# Altium project SoM.PrjPcb (part 2 of 4)

## Sheet [3] RK3399_PMU.SchDoc
size B; Organization: Altium Limited; Address1: L3, 12a Rodborough Rd; Address2: Frenchs Forest; Address3: NSW; Address4: Australia 2086
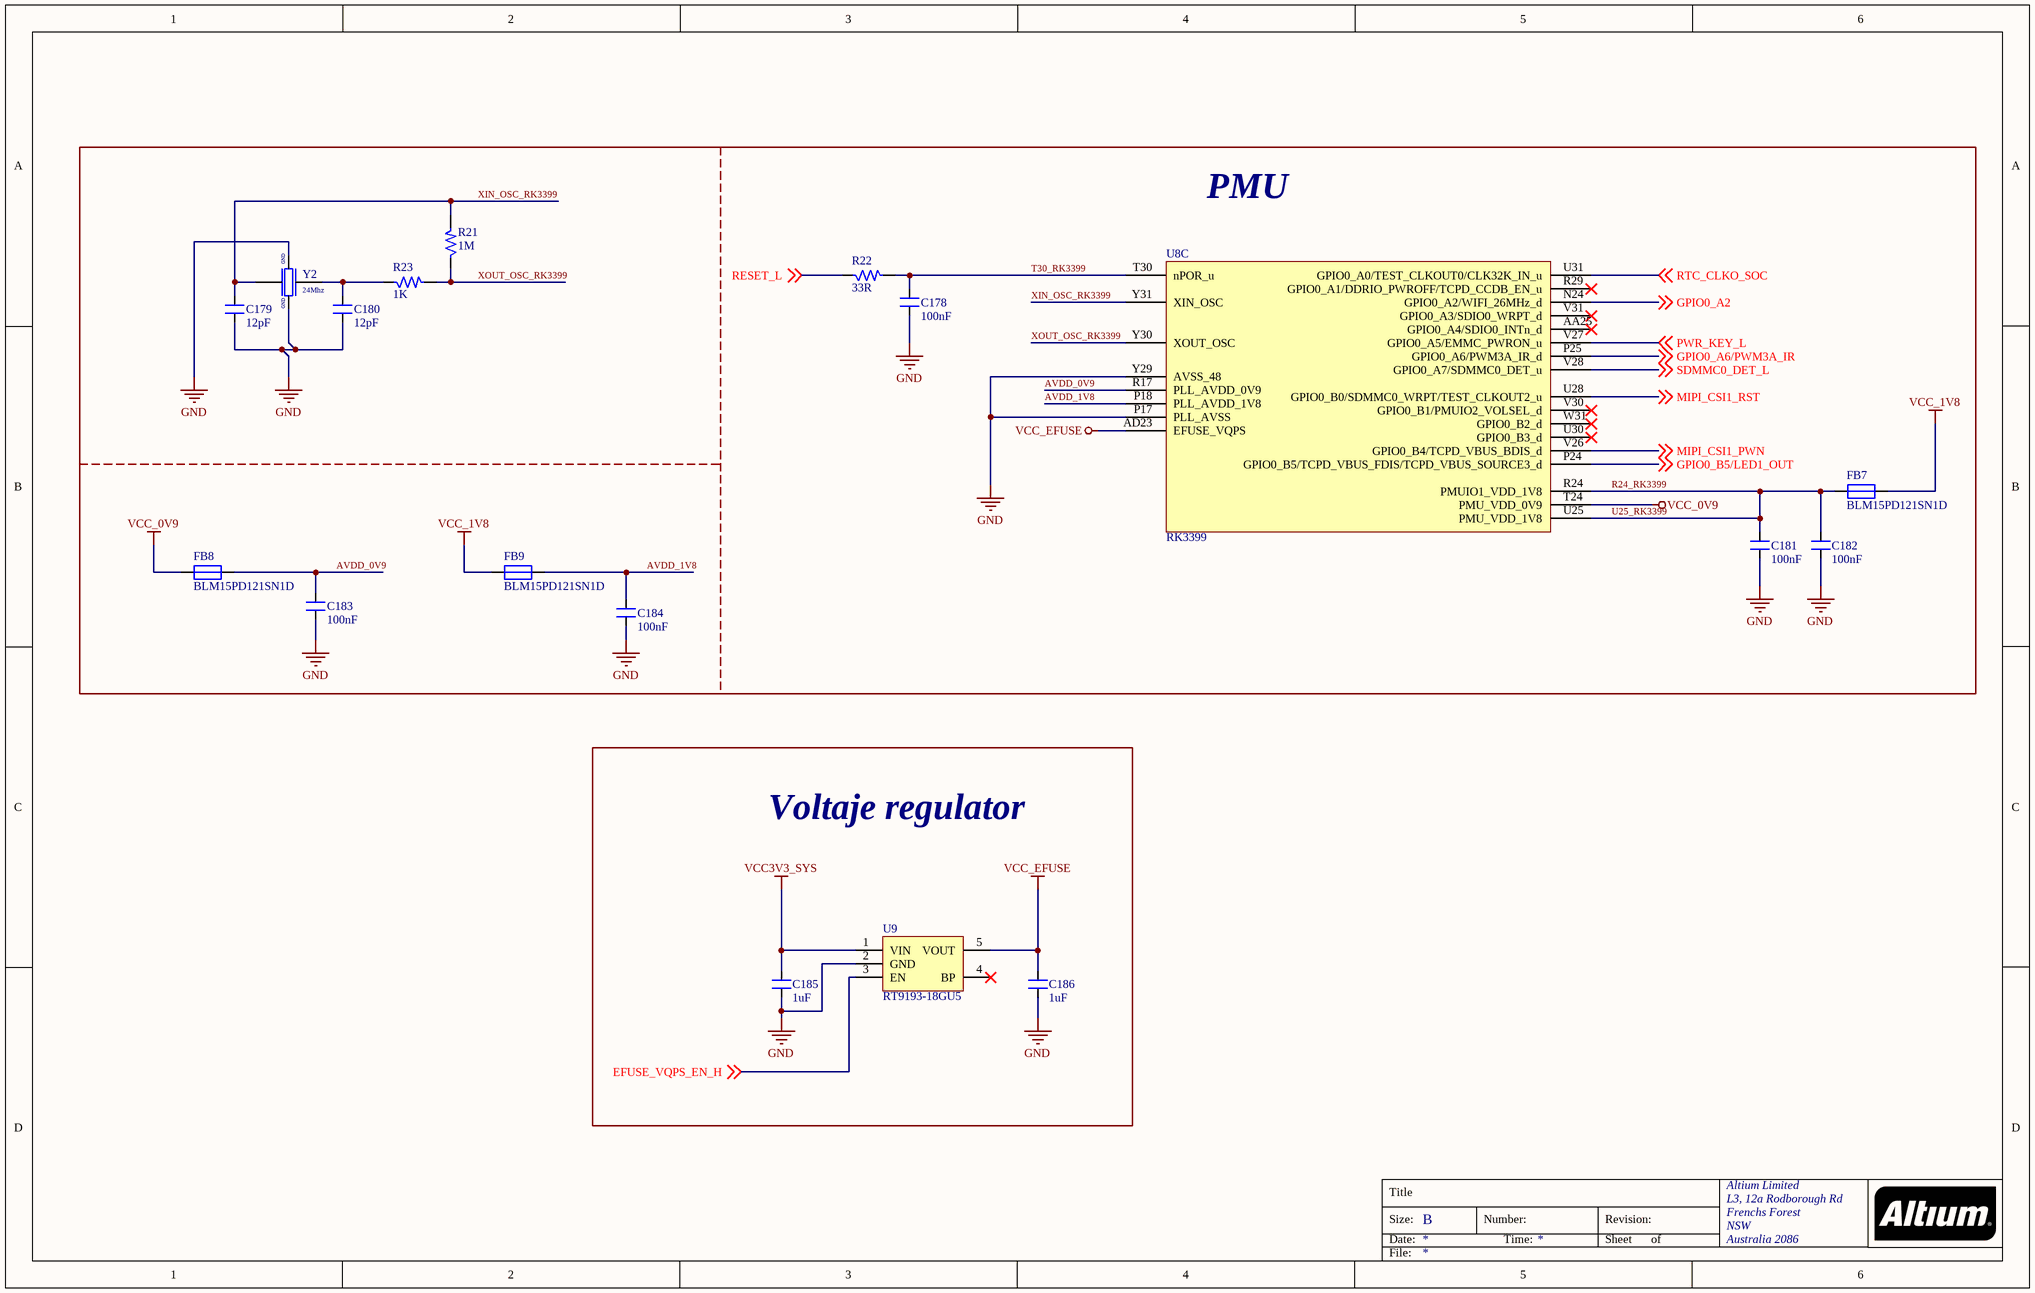
[diagram p6: [3] RK3399_PMU.SchDoc]

### Parts
C178  100nF  [CAP_0201]
C179  12pF  [CAP_0201]
C180  12pF  [CAP_0201]
C181  100nF  [CAP_0201]
C182  100nF  [CAP_0201]
C183  100nF  [CAP_0201]
C184  100nF  [CAP_0201]
C185  1uF  [CAP_0201]
C186  1uF  [CAP_0201]
FB7  BLM15PD121SN1D  [RES_0402]
FB8  BLM15PD121SN1D  [RES_0402]
FB9  BLM15PD121SN1D  [RES_0402]
R21  1M  [RES_0201]
R22  33R  [RES_0201]
R23  1K  [RES_0201]
U8  RK3399  [FBGA828_23_826X826]  (part C of 24)
U9  RT9193-18GU5  [SC70-5]
Y2  24Mhz  [XTAL_ABM8AIG-24.000MHZ-12-2Z-T3]

### Blocks framed on the sheet
PMU: C178-C184 FB7-FB9 R21-R23 U8 Y2
Voltaje regulator: C185 C186 U9

### Nets
GND: C178.1 C179.1 C180.1 C181.1 C182.1 C183.1 C184.1 C185.1 C186.1 U8.P17(PLL_AVSS) U8.Y29(AVSS_48) U9.2(GND) Y2.2 Y2.4
VCC3V3_SYS: C185.2 U9.1(VIN)  [project net VCC7]
VCC_0V9: FB8.1 U8.T24(PMU_VDD_0V9)  [project net EDP_AVDD_0V9]
VCC_1V8: FB7.2 FB9.1  [project net EDP_AVDD_1V8]
VCC_EFUSE: C186.2 U8.AD23(EFUSE_VQPS) U9.5(VOUT)
AVDD_0V9: C183.2 FB8.2 U8.R17(PLL_AVDD_0V9)
AVDD_1V8: C184.2 FB9.2 U8.P18(PLL_AVDD_1V8)
EFUSE_VQPS_EN_H: U9.3(EN) ; off-sheet EFUSE_VQPS_EN_H
GPIO0_A2: U8.N24(GPIO0_A2/WIFI_26MHz_d) ; off-sheet GPIO0_A2
GPIO0_A6/PWM3A_IR: U8.P25(GPIO0_A6/PWM3A_IR_d) ; off-sheet GPIO0_A6/PWM3A_IR
GPIO0_B5/LED1_OUT: U8.P24(GPIO0_B5/TCPD_VBUS_FDIS/TCPD_VBUS_SOURCE3_d) ; off-sheet GPIO0_B5/LED1_OUT
MIPI_CSI1_PWN: U8.V26(GPIO0_B4/TCPD_VBUS_BDIS_d) ; off-sheet MIPI_CSI1_PWN
MIPI_CSI1_RST: U8.U28(GPIO0_B0/SDMMC0_WRPT/TEST_CLKOUT2_u) ; off-sheet MIPI_CSI1_RST
PWR_KEY_L: U8.V27(GPIO0_A5/EMMC_PWRON_u) ; off-sheet PWR_KEY_L
R24_RK3399: C181.2 C182.2 FB7.1 U8.R24(PMUIO1_VDD_1V8) U8.U25(PMU_VDD_1V8)  [also labelled U25_RK3399]
RESET_L: R22.1 ; off-sheet RESET_L  [project net RespWROM]
RTC_CLKO_SOC: U8.U31(GPIO0_A0/TEST_CLKOUT0/CLK32K_IN_u) ; off-sheet RTC_CLKO_SOC
SDMMC0_DET_L: U8.V28(GPIO0_A7/SDMMC0_DET_u) ; off-sheet SDMMC0_DET_L
T30_RK3399: C178.2 R22.2 U8.T30(nPOR_u)
XIN_OSC_RK3399: C179.2 R21.2 U8.Y31(XIN_OSC) Y2.1
XOUT_OSC_RK3399: R21.1 R23.2 U8.Y30(XOUT_OSC)
NetC180_2: C180.2 R23.1 Y2.3

Not connected (* = marked no-connect by the designer): U8 AA25(GPIO0_A4/SDIO0_INTn_d)* R29(GPIO0_A1/DDRIO_PWROFF/TCPD_CCDB_EN_u)* U30(GPIO0_B3_d)* V30(GPIO0_B1/PMUIO2_VOLSEL_d)* V31(GPIO0_A3/SDIO0_WRPT_d)* W31(GPIO0_B2_d)*; U9 4(BP)*

### Notes on the sheet
- Title
- Size:
- Date:
- B
- Number:
- Time:
- Revision:
- Sheet
- of
- File:
- (in symbol XTAL_24Mhz-12pF-4-SMD) GND

### Library data of the parts
C178 C181-C184 = CAP_100nF-25V-10%-0201: as C5 on sheet [9] LPDDR4_SDRAM1; Case/Package: 0201; Supplier-1: Digikey
C179 C180 = CAP_12pF-16V-10%-0201: 12pF ±10% 16V Ceramic Capacitor C0G, NP0 0201 (0603 Metric) /; Manufacturer: AVX Corporation; Manufacturer Part Number: 0201YA120KAT2A; Case/Package: 0201; Supplier-1: Digikey
C185 C186 = CAP_1uF-16V-10%-0201: as C3 on sheet [9] LPDDR4_SDRAM1; Case/Package: 0201; Supplier-1: Digikey
FB7-FB9 = FB_120R-1.3A-100Mhz-0402: as FB1 on sheet [9] LPDDR4_SDRAM1; Mnaufacturer Part Number: BLM15PD121SN1D; Case/Package: 0402; Supplier-1: Digikey
R21 = RES_1M-0.05W-1%-0201: 1 MOhms ±1% 0.05W, 1/20W Chip Resistor 0201 (0603 Metric) Thick Film /; Manufacturer: Yageo; Manufacturer Part Number: RC0201FR-071ML; Case/Package: 0201; Supplier-1: Digikey
R22 = RES_33R-0.05W-1%-0201: 33 Ohms ±1% 0.05W, 1/20W Chip Resistor 0201 (0603 Metric) Thick Film /; Manufacturer: Yageo; Manufacturer Part Number: RC0201FR-0733RL; Case/Package: 0201; Supplier-1: Digikey
R23 = RES_1K-0.05W-1%-0201: 1 kOhms ±1% 0.05W, 1/20W Chip Resistor 0201 (0603 Metric) Thick Film /; Manufacturer: Yageo; Manufacturer Part Number: RC0201FR-071KL; Case/Package: 0201; Supplier-1: Digikey
U8 = IC_RK3399-FCBGA828: as U8 on sheet [1] RK3399_PowerPins; Manufacturer Part Number: RK3399; Case/Package: FCBGA828; Supplier-1: Rockchip
U9 = REG_1.8V-300mA-5.5V-SC70-5: Linear Voltage Regulator IC 1 Output 300mA SC-70-5; Manufacturer: Richtek USA Inc.; Manufacturer Part Number: RT9193-18GU5; Case/Package: SC70-5; Supplier-1: Digikey
Y2 = XTAL_24Mhz-12pF-4-SMD: 24MHz ±20ppm Crystal 12pF 50 Ohms 4-SMD, No Lead /; Manufacturer: Abracon LLC; Manufacturer Part Number: ABM8AIG-24.000MHZ-12-2Z-T3; Case/Package: SMD; Supplier-1: Digikey

## Sheet [4] RK3399_EMMC_ADC_PCIE.SchDoc: RK3399, EMMC and ADCs
size B; DocumentNumber: I; Revision: 01; SheetNumber: 4; SheetTotal: 19
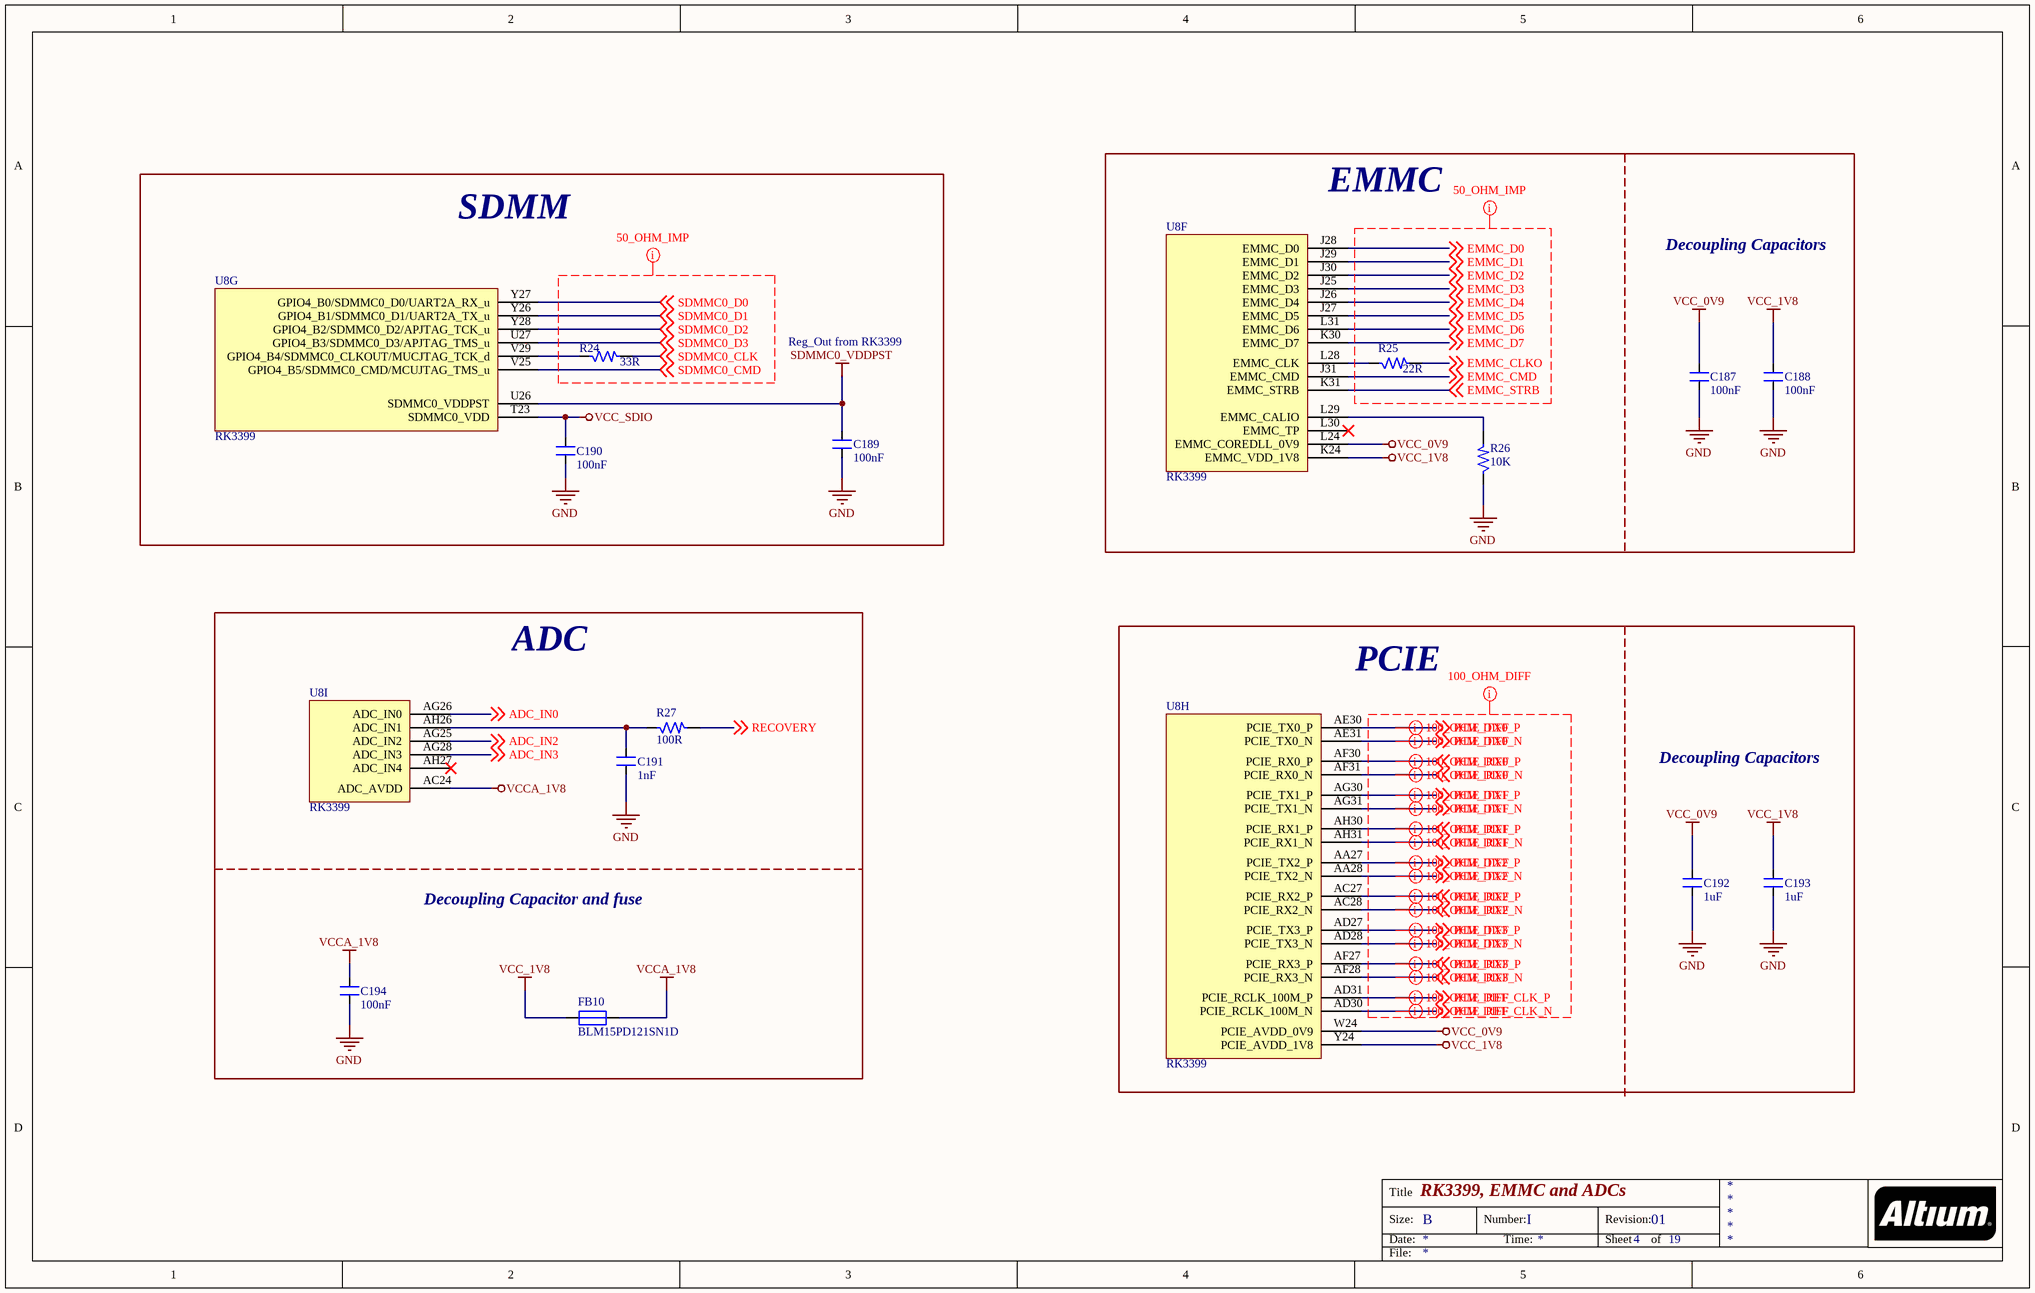
[diagram p7: [4] RK3399_EMMC_ADC_PCIE.SchDoc]

### Parts
C187  100nF  [CAP_0201]
C188  100nF  [CAP_0201]
C189  100nF  [CAP_0201]
C190  100nF  [CAP_0201]
C191  1nF  [CAP_0201]
C192  1uF  [CAP_0201]
C193  1uF  [CAP_0201]
C194  100nF  [CAP_0201]
FB10  BLM15PD121SN1D  [RES_0402]
R24  33R  [RES_0201]
R25  22R  [RES_0201]
R26  10K  [RES_0201]
R27  100R  [RES_0201]
U8  RK3399  [FBGA828_23_826X826]  (parts F,G,H,I of 24)

### Blocks framed on the sheet
SDMM: C189 C190 R24 U8
EMMC: C187 C188 R25 R26 U8
ADC: C191 C194 FB10 R27 U8
PCIE: C192 C193 U8

### Nets
GND: C187.1 C188.1 C189.1 C190.1 C191.1 C192.1 C193.1 C194.1 R26.1
SDMMC0_VDDPST: C189.2 U8.U26(SDMMC0_VDDPST)
VCC_0V9: C187.2 C192.2 U8.L24(EMMC_COREDLL_0V9) U8.W24(PCIE_AVDD_0V9)  [project net EDP_AVDD_0V9]
VCC_1V8: C188.2 C193.2 FB10.1 U8.K24(EMMC_VDD_1V8) U8.Y24(PCIE_AVDD_1V8)  [project net EDP_AVDD_1V8]
VCC_SDIO: C190.2 U8.T23(SDMMC0_VDD)  [project net VLDO4]
VCCA_1V8: C194.2 FB10.2 U8.AC24(ADC_AVDD)
ADC_IN0: U8.AG26(ADC_IN0) ; off-sheet ADC_IN0
ADC_IN2: U8.AG25(ADC_IN2) ; off-sheet ADC_IN2
ADC_IN3: U8.AG28(ADC_IN3) ; off-sheet ADC_IN3
EMMC_CLKO: R25.2 ; off-sheet EMMC_CLKO
EMMC_CMD: U8.J31(EMMC_CMD) ; off-sheet EMMC_CMD
EMMC_D0: U8.J28(EMMC_D0) ; off-sheet EMMC_D0
EMMC_D1: U8.J29(EMMC_D1) ; off-sheet EMMC_D1
EMMC_D2: U8.J30(EMMC_D2) ; off-sheet EMMC_D2
EMMC_D3: U8.J25(EMMC_D3) ; off-sheet EMMC_D3
EMMC_D4: U8.J26(EMMC_D4) ; off-sheet EMMC_D4
EMMC_D5: U8.J27(EMMC_D5) ; off-sheet EMMC_D5
EMMC_D6: U8.L31(EMMC_D6) ; off-sheet EMMC_D6
EMMC_D7: U8.K30(EMMC_D7) ; off-sheet EMMC_D7
EMMC_STRB: U8.K31(EMMC_STRB) ; off-sheet EMMC_STRB
PCIE_REF_CLK_N: U8.AD30(PCIE_RCLK_100M_N) ; off-sheet PCIE_REF_CLK_N
PCIE_REF_CLK_P: U8.AD31(PCIE_RCLK_100M_P) ; off-sheet PCIE_REF_CLK_P
PCIE_RX0_N: U8.AF31(PCIE_RX0_N) ; off-sheet PCIE_RX0_N
PCIE_RX0_P: U8.AF30(PCIE_RX0_P) ; off-sheet PCIE_RX0_P
PCIE_RX1_N: U8.AH31(PCIE_RX1_N) ; off-sheet PCIE_RX1_N
PCIE_RX1_P: U8.AH30(PCIE_RX1_P) ; off-sheet PCIE_RX1_P
PCIE_RX2_N: U8.AC28(PCIE_RX2_N) ; off-sheet PCIE_RX2_N
PCIE_RX2_P: U8.AC27(PCIE_RX2_P) ; off-sheet PCIE_RX2_P
PCIE_RX3_N: U8.AF28(PCIE_RX3_N) ; off-sheet PCIE_RX3_N
PCIE_RX3_P: U8.AF27(PCIE_RX3_P) ; off-sheet PCIE_RX3_P
PCIE_TX0_N: U8.AE31(PCIE_TX0_N) ; off-sheet PCIE_TX0_N
PCIE_TX0_P: U8.AE30(PCIE_TX0_P) ; off-sheet PCIE_TX0_P
PCIE_TX1_N: U8.AG31(PCIE_TX1_N) ; off-sheet PCIE_TX1_N
PCIE_TX1_P: U8.AG30(PCIE_TX1_P) ; off-sheet PCIE_TX1_P
PCIE_TX2_N: U8.AA28(PCIE_TX2_N) ; off-sheet PCIE_TX2_N
PCIE_TX2_P: U8.AA27(PCIE_TX2_P) ; off-sheet PCIE_TX2_P
PCIE_TX3_N: U8.AD28(PCIE_TX3_N) ; off-sheet PCIE_TX3_N
PCIE_TX3_P: U8.AD27(PCIE_TX3_P) ; off-sheet PCIE_TX3_P
RECOVERY: R27.2 ; off-sheet RECOVERY
SDMMC0_CLK: R24.2 ; off-sheet SDMMC0_CLK
SDMMC0_CMD: U8.V25(GPIO4_B5/SDMMC0_CMD/MCUJTAG_TMS_u) ; off-sheet SDMMC0_CMD
SDMMC0_D0: U8.Y27(GPIO4_B0/SDMMC0_D0/UART2A_RX_u) ; off-sheet SDMMC0_D0
SDMMC0_D1: U8.Y26(GPIO4_B1/SDMMC0_D1/UART2A_TX_u) ; off-sheet SDMMC0_D1
SDMMC0_D2: U8.Y28(GPIO4_B2/SDMMC0_D2/APJTAG_TCK_u) ; off-sheet SDMMC0_D2
SDMMC0_D3: U8.U27(GPIO4_B3/SDMMC0_D3/APJTAG_TMS_u) ; off-sheet SDMMC0_D3
NetC191_2: C191.2 R27.1 U8.AH26(ADC_IN1)
NetR24_1: R24.1 U8.V29(GPIO4_B4/SDMMC0_CLKOUT/MUCJTAG_TCK_d)
NetR25_1: R25.1 U8.L28(EMMC_CLK)
NetR26_2: R26.2 U8.L29(EMMC_CALIO)

Not connected (* = marked no-connect by the designer): U8 AH27(ADC_IN4)* L30(EMMC_TP)*

### Layout directives
mark named 50_OHM_IMP: EMMC_CLKO, EMMC_CMD, EMMC_D0, EMMC_D1, EMMC_D2, EMMC_D3, EMMC_D4, EMMC_D5, EMMC_D6, EMMC_D7, EMMC_STRB, SDMMC0_CLK, SDMMC0_CMD, SDMMC0_D0, SDMMC0_D1, SDMMC0_D2, SDMMC0_D3
mark named 100_OHM_DIFF: PCIE_REF_CLK_N, PCIE_REF_CLK_P, PCIE_RX0_N, PCIE_RX0_P, PCIE_RX1_N, PCIE_RX1_P, PCIE_RX2_N, PCIE_RX2_P, PCIE_RX3_N, PCIE_RX3_P, PCIE_TX0_N, PCIE_TX0_P, PCIE_TX1_N, PCIE_TX1_P, PCIE_TX2_N, PCIE_TX2_P, PCIE_TX3_N, PCIE_TX3_P
differential pair: PCIE_REF_CLK_N, PCIE_REF_CLK_P, PCIE_RX0_N, PCIE_RX0_P, PCIE_RX1_N, PCIE_RX1_P, PCIE_RX2_N, PCIE_RX2_P, PCIE_RX3_N, PCIE_RX3_P, PCIE_TX0_N, PCIE_TX0_P, PCIE_TX1_N, PCIE_TX1_P, PCIE_TX2_N, PCIE_TX2_P, PCIE_TX3_N, PCIE_TX3_P

### Notes on the sheet
- Decoupling Capacitors
- Reg_Out from RK3399
- Decoupling Capacitor and fuse
- Title
- Size:
- Date:
- B
- Number:
- Time:
- Revision:
- Sheet
- of
- File:

### Library data of the parts
C187-C190 C194 = CAP_100nF-25V-10%-0201: 0.1µF ±10% 25V Ceramic Capacitor X5R 0201 (0603 Metric) /; Manufacturer: TDK Corporation; Manufacturer Part Number: C0603X5R1E104K030BB; Case/Package: 0201; Supplier-1: Digikey
C191 = CAP_1nF-16V-10%-0201: 1000pF ±10% 16V Ceramic Capacitor X7R 0201 (0603 Metric) /; Manufacturer: Murata Electronics; Manufacturer Part Number: GRM033R71C102KA01D; Case/Package: 0201; Supplier-1: Digikey
C192 C193 = CAP_1uF-16V-10%-0201: 1µF ±20% 16V Ceramic Capacitor X5R 0201 (0603 Metric) /; Manufacturer: Samsung Electro-Mechanics; Manufacturer Part Number: CL03A105MO3NRNH; Case/Package: 0201; Supplier-1: Digikey
FB10 = FB_120R-1.3A-100Mhz-0402: 120 Ohms @ 100MHz 1 Power Line Ferrite Bead 0402 (1005 Metric) 1.3A 90mOhm; Manufacturer: Murata Electronics; Mnaufacturer Part Number: BLM15PD121SN1D; Case/Package: 0402; Supplier-1: Digikey
R24 = RES_33R-0.05W-1%-0201: 33 Ohms ±1% 0.05W, 1/20W Chip Resistor 0201 (0603 Metric) Thick Film /; Manufacturer: Yageo; Manufacturer Part Number: RC0201FR-0733RL; Case/Package: 0201; Supplier-1: Digikey
R25 = RES_22R-0.05W-1%-0201: 22 Ohms ±1% 0.05W, 1/20W Chip Resistor 0201 (0603 Metric) Moisture Resistant Thick Film /; Manufacturer: Yageo; Manufacturer Part Number: RC0201FR-0722RL; Case/Package: 0201; Supplier-1: Digikey
R26 = RES_10K-0.05W-1%-0201: 10 kOhms ±1% 0.05W, 1/20W Chip Resistor 0201 (0603 Metric) Thick Film /; Manufacturer: Stackpole Electronics Inc; Manufacturer Part Number: RMCF0201FT10K0; Case/Package: 0201; Supplier-1: Digikey
R27 = RES_100R-0.05W-1%-0201: 100 kOhms ±1% 0.05W, 1/20W Chip Resistor 0201 (0603 Metric) Automotive AEC-Q200 Thick Film /; Manufacturer: Panasonic Electronic Components; Manufacturer Part Number: ERJ-1GNF1003C; Case/Package: 0201; Supplier-1: Digikey
U8 = IC_RK3399-FCBGA828: RK3399 is a low power, high performance processor for computing, personal mobile.; Manufacturer: Rockchip; Manufacturer Part Number: RK3399; Case/Package: FCBGA828; Supplier-1: Rockchip

## Sheet [5] RK3399_EDP_CSI_HDMI.SchDoc: RK3399, EDP, CSI and HDMI
size B; DocumentNumber: I; Revision: 01; SheetNumber: 5; SheetTotal: 19
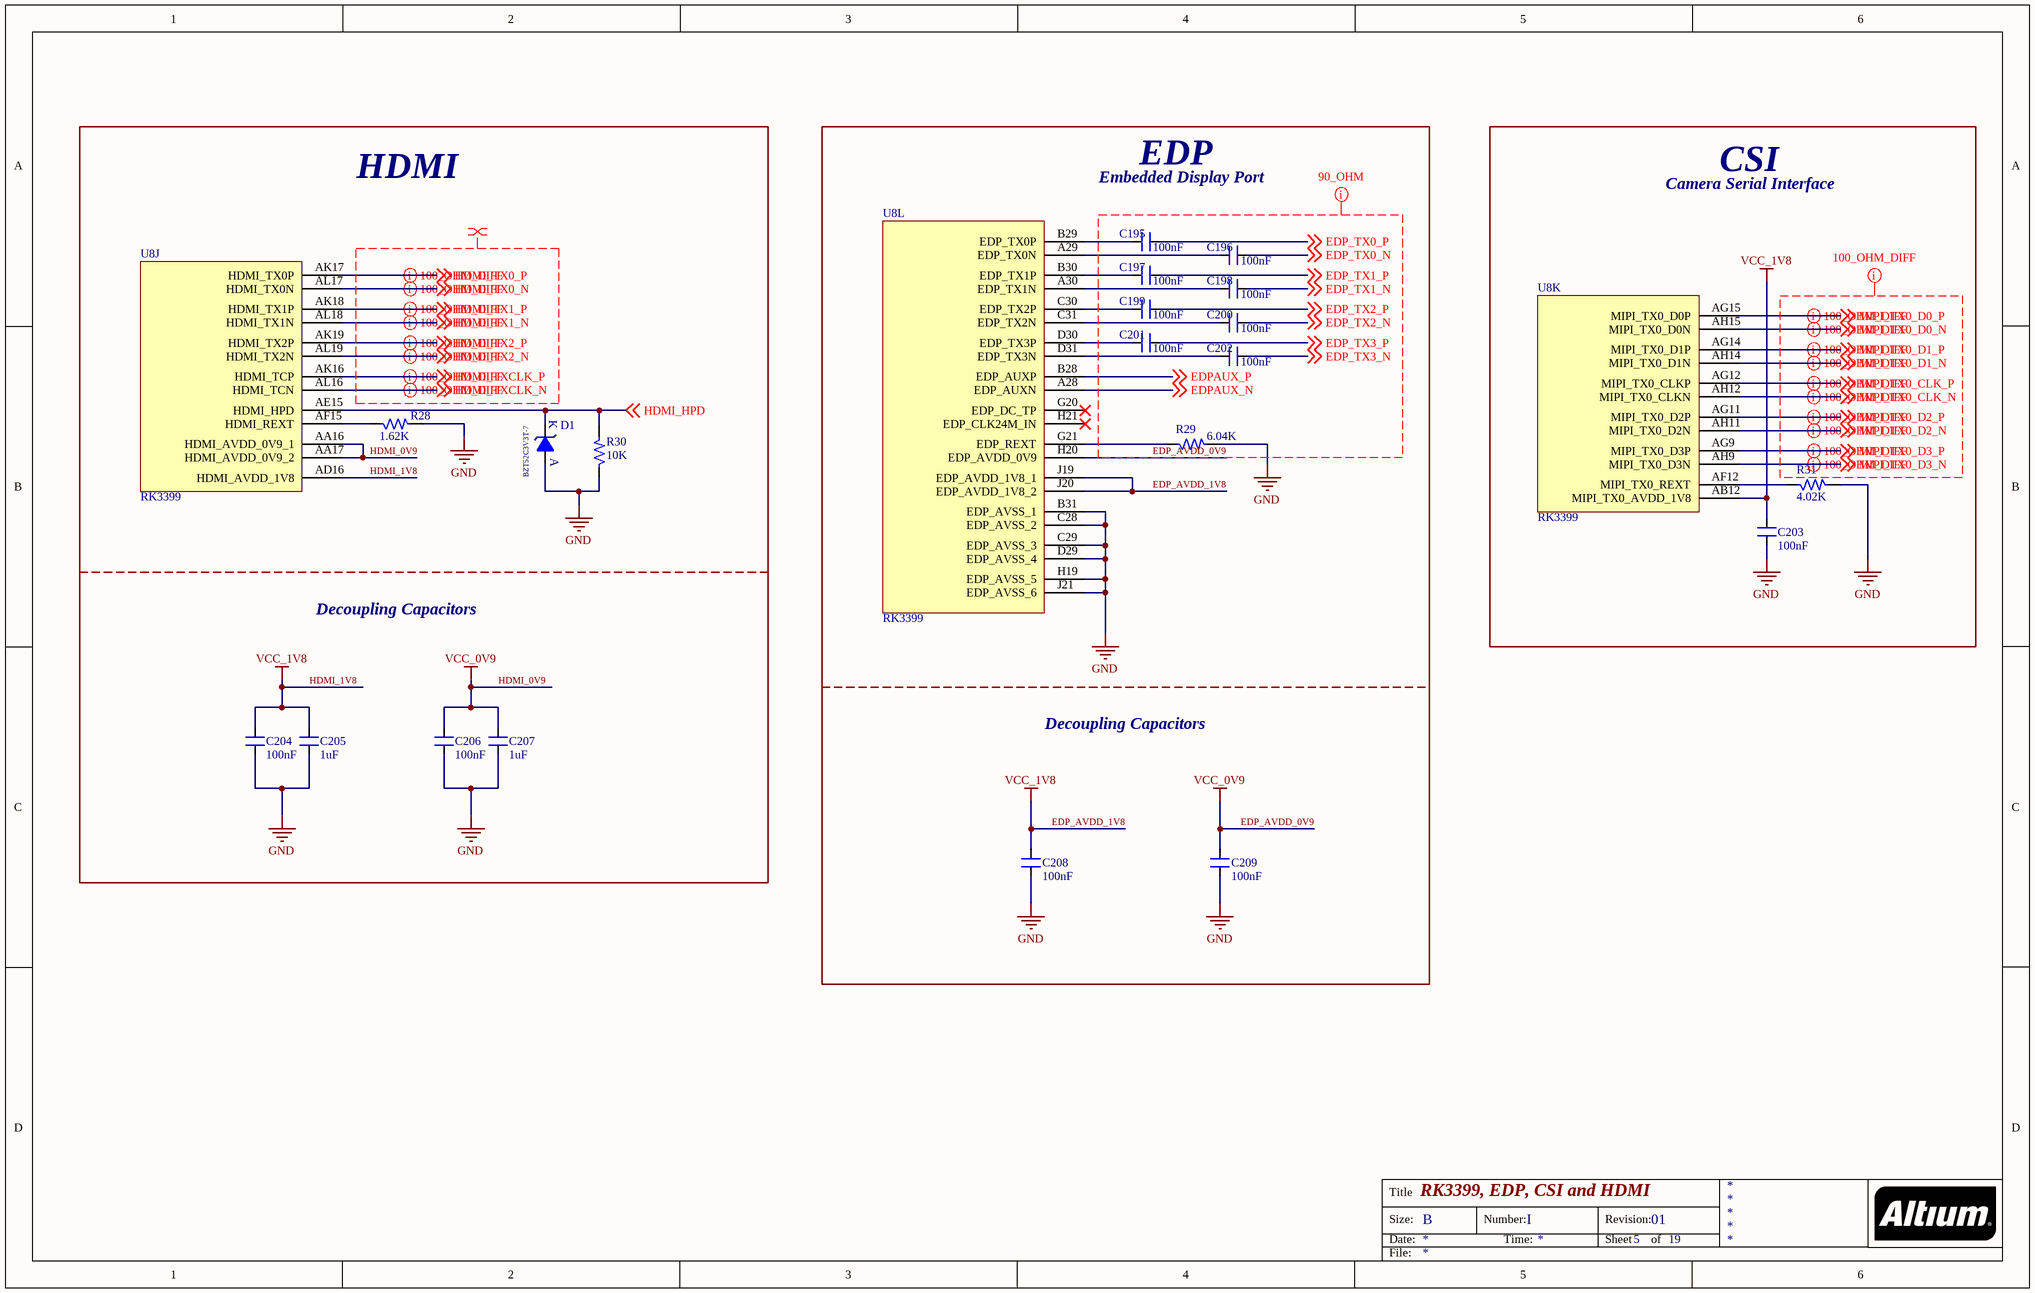
[diagram p8: [5] RK3399_EDP_CSI_HDMI.SchDoc]

### Parts
C195  100nF  [CAP_0201]
C196  100nF  [CAP_0201]
C197  100nF  [CAP_0201]
C198  100nF  [CAP_0201]
C199  100nF  [CAP_0201]
C200  100nF  [CAP_0201]
C201  100nF  [CAP_0201]
C202  100nF  [CAP_0201]
C203  100nF  [CAP_0201]
C204  100nF  [CAP_0201]
C205  1uF  [CAP_0201]
C206  100nF  [CAP_0201]
C207  1uF  [CAP_0201]
C208  100nF  [CAP_0201]
C209  100nF  [CAP_0201]
D1  BZT52C3V3T-7  [DIO_SOD523]
R28  1.62K  [RES_0201]
R29  6.04K  [RES_0201]
R30  10K  [RES_0201]
R31  4.02K  [RES_0201]
U8  RK3399  [FBGA828_23_826X826]  (parts J,K,L of 24)

### Blocks framed on the sheet
HDMI: C204-C207 D1 R28 R30 U8
EDP: C195-C202 C208 C209 R29 U8
CSI: C203 R31 U8

### Nets
EDP_AVDD_0V9: C206.2 C207.2 C209.2 U8.AA16(HDMI_AVDD_0V9_1) U8.AA17(HDMI_AVDD_0V9_2) U8.H20(EDP_AVDD_0V9)  [also labelled HDMI_0V9, VCC_0V9]
EDP_AVDD_1V8: C203.2 C204.2 C205.2 C208.2 U8.AB12(MIPI_TX0_AVDD_1V8) U8.AD16(HDMI_AVDD_1V8) U8.J19(EDP_AVDD_1V8_1) U8.J20(EDP_AVDD_1V8_2)  [also labelled HDMI_1V8, VCC_1V8]
GND: C203.1 C204.1 C205.1 C206.1 C207.1 C208.1 C209.1 D1.A R28.2 R29.2 R30.1 R31.2 U8.B31(EDP_AVSS_1) U8.C28(EDP_AVSS_2) U8.C29(EDP_AVSS_3) U8.D29(EDP_AVSS_4) U8.H19(EDP_AVSS_5) U8.J21(EDP_AVSS_6)
EDP_TX0_N: C196.2 ; off-sheet EDP_TX0_N
EDP_TX0_P: C195.2 ; off-sheet EDP_TX0_P
EDP_TX1_N: C198.2 ; off-sheet EDP_TX1_N
EDP_TX1_P: C197.2 ; off-sheet EDP_TX1_P
EDP_TX2_N: C200.2 ; off-sheet EDP_TX2_N
EDP_TX2_P: C199.2 ; off-sheet EDP_TX2_P
EDP_TX3_N: C202.2 ; off-sheet EDP_TX3_N
EDP_TX3_P: C201.2 ; off-sheet EDP_TX3_P
EDPAUX_N: U8.A28(EDP_AUXN) ; off-sheet EDPAUX_N
EDPAUX_P: U8.B28(EDP_AUXP) ; off-sheet EDPAUX_P
HDMI_HPD: D1.K R30.2 U8.AE15(HDMI_HPD) ; off-sheet HDMI_HPD
HDMI_TX0_N: U8.AL17(HDMI_TX0N) ; off-sheet HDMI_TX0_N
HDMI_TX0_P: U8.AK17(HDMI_TX0P) ; off-sheet HDMI_TX0_P
HDMI_TX1_N: U8.AL18(HDMI_TX1N) ; off-sheet HDMI_TX1_N
HDMI_TX1_P: U8.AK18(HDMI_TX1P) ; off-sheet HDMI_TX1_P
HDMI_TX2_N: U8.AL19(HDMI_TX2N) ; off-sheet HDMI_TX2_N
HDMI_TX2_P: U8.AK19(HDMI_TX2P) ; off-sheet HDMI_TX2_P
HDMI_TXCLK_N: U8.AL16(HDMI_TCN) ; off-sheet HDMI_TXCLK_N
HDMI_TXCLK_P: U8.AK16(HDMI_TCP) ; off-sheet HDMI_TXCLK_P
MIPI_TX0_CLK_N: U8.AH12(MIPI_TX0_CLKN) ; off-sheet MIPI_TX0_CLK_N
MIPI_TX0_CLK_P: U8.AG12(MIPI_TX0_CLKP) ; off-sheet MIPI_TX0_CLK_P
MIPI_TX0_D0_N: U8.AH15(MIPI_TX0_D0N) ; off-sheet MIPI_TX0_D0_N
MIPI_TX0_D0_P: U8.AG15(MIPI_TX0_D0P) ; off-sheet MIPI_TX0_D0_P
MIPI_TX0_D1_N: U8.AH14(MIPI_TX0_D1N) ; off-sheet MIPI_TX0_D1_N
MIPI_TX0_D1_P: U8.AG14(MIPI_TX0_D1P) ; off-sheet MIPI_TX0_D1_P
MIPI_TX0_D2_N: U8.AH11(MIPI_TX0_D2N) ; off-sheet MIPI_TX0_D2_N
MIPI_TX0_D2_P: U8.AG11(MIPI_TX0_D2P) ; off-sheet MIPI_TX0_D2_P
MIPI_TX0_D3_N: U8.AH9(MIPI_TX0_D3N) ; off-sheet MIPI_TX0_D3_N
MIPI_TX0_D3_P: U8.AG9(MIPI_TX0_D3P) ; off-sheet MIPI_TX0_D3_P
NetC195_1: C195.1 U8.B29(EDP_TX0P)
NetC196_1: C196.1 U8.A29(EDP_TX0N)
NetC197_1: C197.1 U8.B30(EDP_TX1P)
NetC198_1: C198.1 U8.A30(EDP_TX1N)
NetC199_1: C199.1 U8.C30(EDP_TX2P)
NetC200_1: C200.1 U8.C31(EDP_TX2N)
NetC201_1: C201.1 U8.D30(EDP_TX3P)
NetC202_1: C202.1 U8.D31(EDP_TX3N)
NetR28_1: R28.1 U8.AF15(HDMI_REXT)
NetR29_1: R29.1 U8.G21(EDP_REXT)
NetR31_1: R31.1 U8.AF12(MIPI_TX0_REXT)

Not connected (* = marked no-connect by the designer): U8 G20(EDP_DC_TP)* H21(EDP_CLK24M_IN)*

### Layout directives
differential pair: HDMI_TX0_N, HDMI_TX0_P, HDMI_TX1_N, HDMI_TX1_P, HDMI_TX2_N, HDMI_TX2_P, HDMI_TXCLK_N, HDMI_TXCLK_P, MIPI_TX0_CLK_N, MIPI_TX0_CLK_P, MIPI_TX0_D0_N, MIPI_TX0_D0_P, MIPI_TX0_D1_N, MIPI_TX0_D1_P, MIPI_TX0_D2_N, MIPI_TX0_D2_P, MIPI_TX0_D3_N, MIPI_TX0_D3_P
mark named 100_OHM_DIFF: MIPI_TX0_CLK_N, MIPI_TX0_CLK_P, MIPI_TX0_D0_N, MIPI_TX0_D0_P, MIPI_TX0_D1_N, MIPI_TX0_D1_P, MIPI_TX0_D2_N, MIPI_TX0_D2_P, MIPI_TX0_D3_N, MIPI_TX0_D3_P
mark named 90_OHM: EDP_AVDD_0V9, EDP_TX0_N, EDP_TX0_P, EDP_TX1_N, EDP_TX1_P, EDP_TX2_N, EDP_TX2_P, EDP_TX3_N, EDP_TX3_P, EDPAUX_N, EDPAUX_P

### Notes on the sheet
- Embedded Display Port
- Camera Serial Interface
- Decoupling Capacitors
- Title
- Size:
- Date:
- B
- Number:
- Time:
- Revision:
- Sheet
- of
- File:

### Library data of the parts
C195-C204 C206 C208 C209 = CAP_100nF-25V-10%-0201: as C187-C190 on sheet [4] RK3399_EMMC_ADC_PCIE; Case/Package: 0201; Supplier-1: Digikey
C205 C207 = CAP_1uF-16V-10%-0201: as C192 on sheet [4] RK3399_EMMC_ADC_PCIE; Case/Package: 0201; Supplier-1: Digikey
D1 = DIO-Z_3.3V-300mW-SOD-523: Zener Diode 3.3V 300mW ±6% Surface Mount SOD-523 /; Manufacturer: Diodes Incorporated; Manufacturer Part Number: BZT52C3V3T-7; Case/Package: SOD523; Supplier-1: Digikey
R28 = RES_1.62K-0.05W-1%-0201: 1.62 kOhms ±1% 0.05W, 1/20W Chip Resistor 0201 (0603 Metric) Automotive AEC-Q200 Thick Film /; Manufacturer: Panasonic Electronic Components; Manufacturer Part Number: ERJ-1GNF1621C; Case/Package: 0201; Supplier-1: Digikey
R29 = RES_6.04K-0.05W-1%-0201: 6.04 kOhms ±1% 0.05W, 1/20W Chip Resistor 0201 (0603 Metric) Thick Film /; Manufacturer: Panasonic Electronic Components; Manufacturer Part Number: ERJ-1GEF6041C; Case/Package: 0201; Supplier-1: Digikey
R30 = RES_10K-0.05W-1%-0201: as R26 on sheet [4] RK3399_EMMC_ADC_PCIE; Case/Package: 0201; Supplier-1: Digikey
R31 = RES_4.02K-0.05W-1%-0201: 4.02 kOhms ±1% 0.05W, 1/20W Chip Resistor 0201 (0603 Metric) Thick Film /; Manufacturer: Yageo; Manufacturer Part Number: RC0201FR-074K02L; Case/Package: 0201; Supplier-1: Digikey
U8 = IC_RK3399-FCBGA828: as U8 on sheet [4] RK3399_EMMC_ADC_PCIE; Manufacturer Part Number: RK3399; Case/Package: FCBGA828; Supplier-1: Rockchip

## Sheet [6] RK3399_USB2_USIC.SchDoc: RK3399, USB2 and USIC
size B; DocumentNumber: I; Revision: 01; SheetNumber: 6; SheetTotal: 19
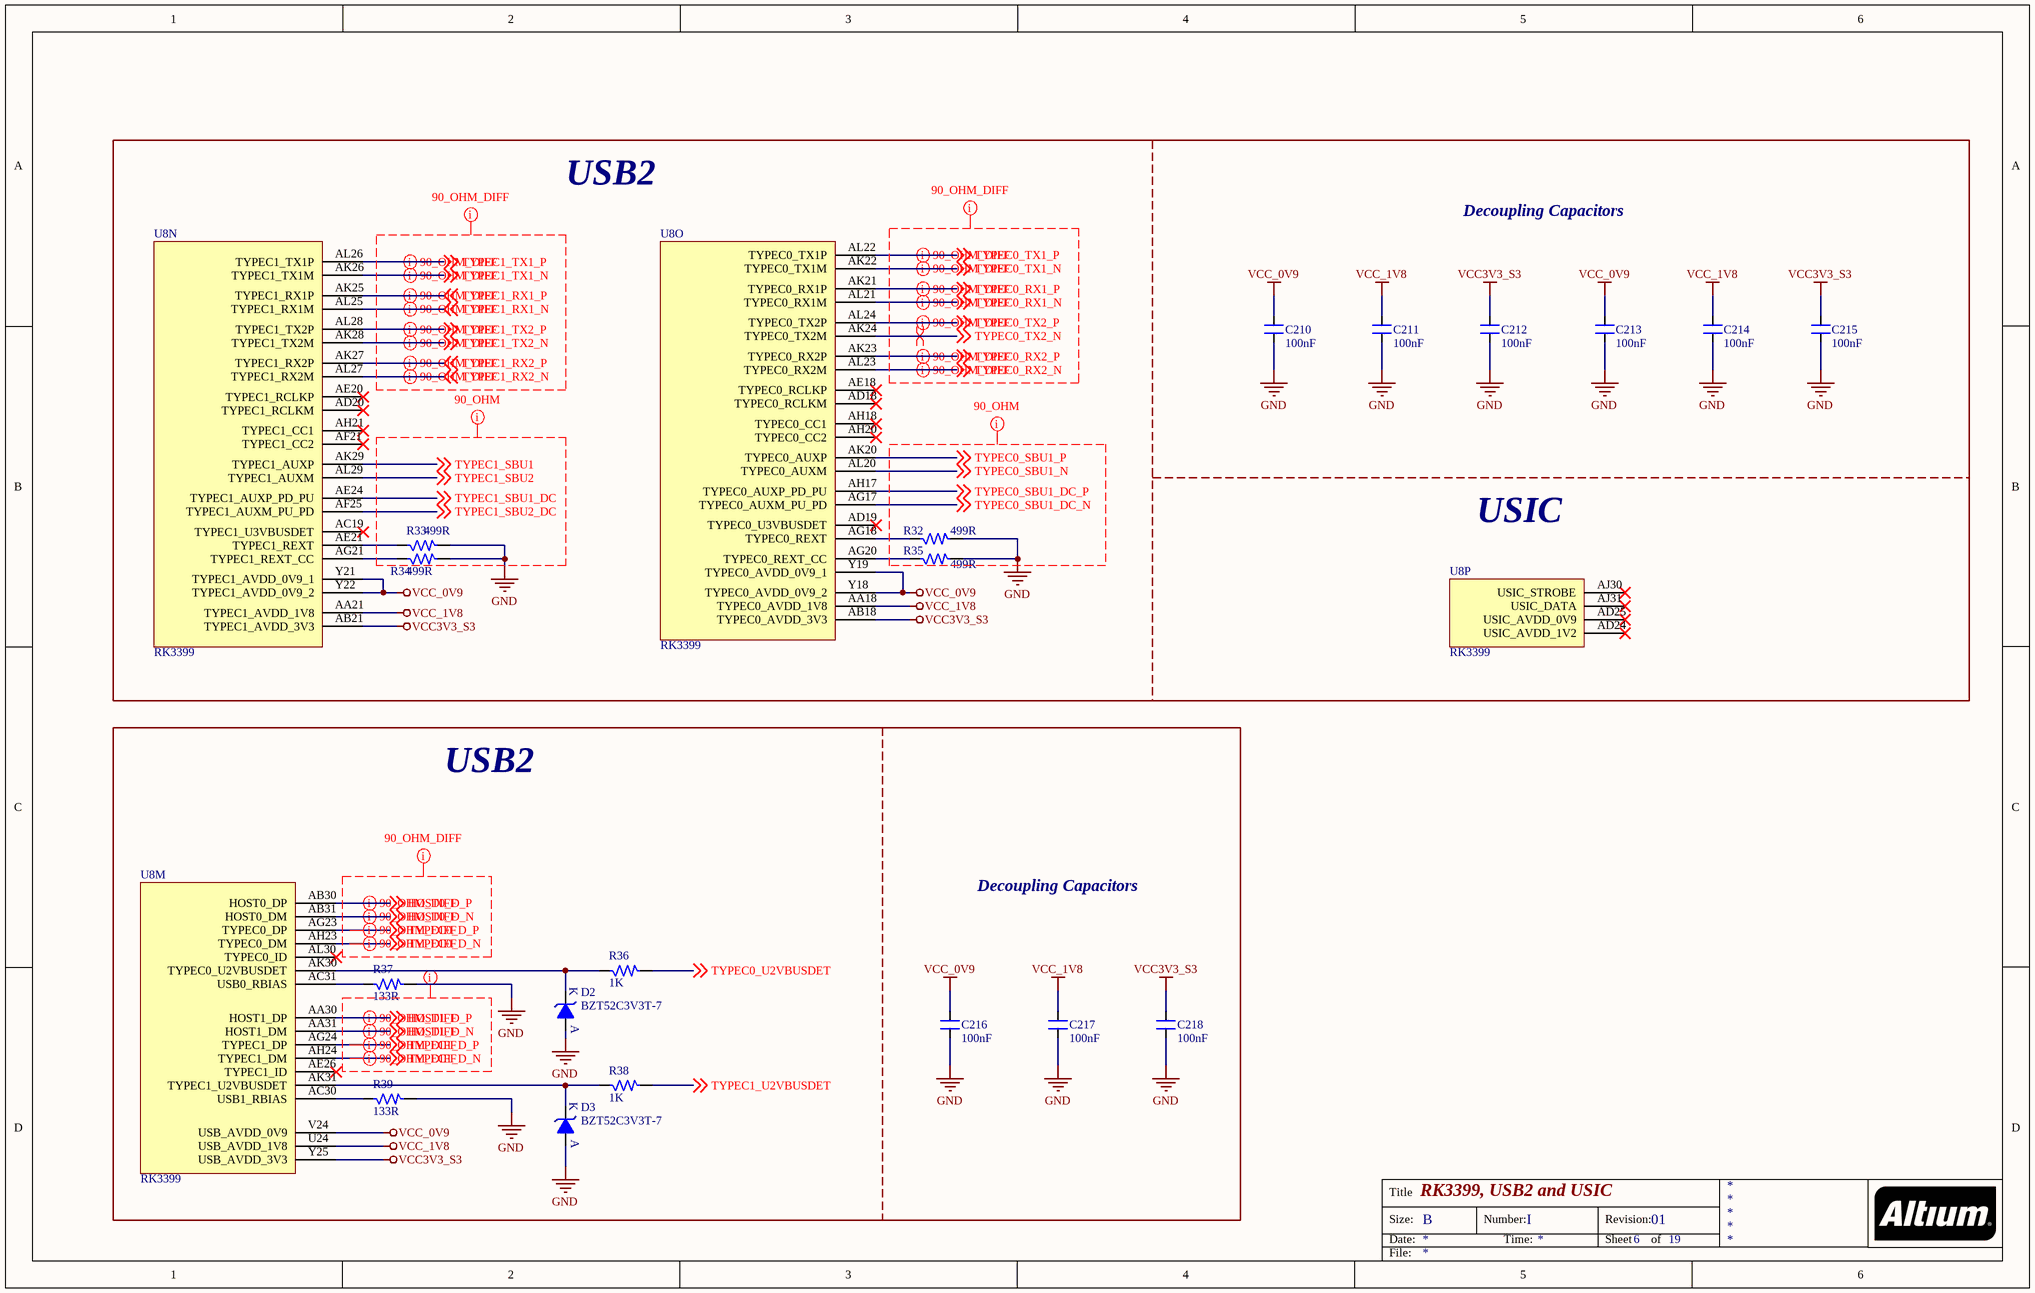
[diagram p9: [6] RK3399_USB2_USIC.SchDoc]

### Parts
C210  100nF  [CAP_0201]
C211  100nF  [CAP_0201]
C212  100nF  [CAP_0201]
C213  100nF  [CAP_0201]
C214  100nF  [CAP_0201]
C215  100nF  [CAP_0201]
C216  100nF  [CAP_0201]
C217  100nF  [CAP_0201]
C218  100nF  [CAP_0201]
D2  BZT52C3V3T-7  [DIO_SOD523]
D3  BZT52C3V3T-7  [DIO_SOD523]
R32  499R  [RES_0201]
R33  499R  [RES_0201]
R34  499R  [RES_0201]
R35  499R  [RES_0201]
R36  1K  [RES_0201]
R37  133R  [RES_0201]
R38  1K  [RES_0201]
R39  133R  [RES_0201]
U8  RK3399  [FBGA828_23_826X826]  (parts M,N,O,P of 24)

### Blocks framed on the sheet
USB2: C216-C218 D2 D3 R36-R39 U8

### Nets
GND: C210.1 C211.1 C212.1 C213.1 C214.1 C215.1 C216.1 C217.1 C218.1 D2.A D3.A R32.2 R33.2 R34.2 R35.2 R37.2 R39.2
VCC3V3_S3: C212.2 C215.2 C218.2 U8.AB18(TYPEC0_AVDD_3V3) U8.AB21(TYPEC1_AVDD_3V3) U8.Y25(USB_AVDD_3V3)  [project net VSOUT1]
VCC_0V9: C210.2 C213.2 C216.2 U8.V24(USB_AVDD_0V9) U8.Y18(TYPEC0_AVDD_0V9_2) U8.Y19(TYPEC0_AVDD_0V9_1) U8.Y21(TYPEC1_AVDD_0V9_1) U8.Y22(TYPEC1_AVDD_0V9_2)  [project net EDP_AVDD_0V9]
VCC_1V8: C211.2 C214.2 C217.2 U8.AA18(TYPEC0_AVDD_1V8) U8.AA21(TYPEC1_AVDD_1V8) U8.U24(USB_AVDD_1V8)  [project net EDP_AVDD_1V8]
HOST0_D_N: U8.AB31(HOST0_DM) ; off-sheet HOST0_D_N
HOST0_D_P: U8.AB30(HOST0_DP) ; off-sheet HOST0_D_P
HOST1_D_N: U8.AA31(HOST1_DM) ; off-sheet HOST1_D_N
HOST1_D_P: U8.AA30(HOST1_DP) ; off-sheet HOST1_D_P
TYPEC0_D_N: U8.AH23(TYPEC0_DM) ; off-sheet TYPEC0_D_N
TYPEC0_D_P: U8.AG23(TYPEC0_DP) ; off-sheet TYPEC0_D_P
TYPEC0_RX1_N: U8.AL21(TYPEC0_RX1M) ; off-sheet TYPEC0_RX1_N
TYPEC0_RX1_P: U8.AK21(TYPEC0_RX1P) ; off-sheet TYPEC0_RX1_P
TYPEC0_RX2_N: U8.AL23(TYPEC0_RX2M) ; off-sheet TYPEC0_RX2_N
TYPEC0_RX2_P: U8.AK23(TYPEC0_RX2P) ; off-sheet TYPEC0_RX2_P
TYPEC0_SBU1_DC_N: U8.AG17(TYPEC0_AUXM_PU_PD) ; off-sheet TYPEC0_SBU1_DC_N
TYPEC0_SBU1_DC_P: U8.AH17(TYPEC0_AUXP_PD_PU) ; off-sheet TYPEC0_SBU1_DC_P
TYPEC0_SBU1_N: U8.AL20(TYPEC0_AUXM) ; off-sheet TYPEC0_SBU1_N
TYPEC0_SBU1_P: U8.AK20(TYPEC0_AUXP) ; off-sheet TYPEC0_SBU1_P
TYPEC0_TX1_N: U8.AK22(TYPEC0_TX1M) ; off-sheet TYPEC0_TX1_N
TYPEC0_TX1_P: U8.AL22(TYPEC0_TX1P) ; off-sheet TYPEC0_TX1_P
TYPEC0_TX2_N: U8.AK24(TYPEC0_TX2M) ; off-sheet TYPEC0_TX2_N
TYPEC0_TX2_P: U8.AL24(TYPEC0_TX2P) ; off-sheet TYPEC0_TX2_P
TYPEC0_U2VBUSDET: R36.2 ; off-sheet TYPEC0_U2VBUSDET
TYPEC1_D_N: U8.AH24(TYPEC1_DM) ; off-sheet TYPEC1_D_N
TYPEC1_D_P: U8.AG24(TYPEC1_DP) ; off-sheet TYPEC1_D_P
TYPEC1_RX1_N: U8.AL25(TYPEC1_RX1M) ; off-sheet TYPEC1_RX1_N
TYPEC1_RX1_P: U8.AK25(TYPEC1_RX1P) ; off-sheet TYPEC1_RX1_P
TYPEC1_RX2_N: U8.AL27(TYPEC1_RX2M) ; off-sheet TYPEC1_RX2_N
TYPEC1_RX2_P: U8.AK27(TYPEC1_RX2P) ; off-sheet TYPEC1_RX2_P
TYPEC1_SBU1: U8.AK29(TYPEC1_AUXP) ; off-sheet TYPEC1_SBU1
TYPEC1_SBU1_DC: U8.AE24(TYPEC1_AUXP_PD_PU) ; off-sheet TYPEC1_SBU1_DC
TYPEC1_SBU2: U8.AL29(TYPEC1_AUXM) ; off-sheet TYPEC1_SBU2
TYPEC1_SBU2_DC: U8.AF25(TYPEC1_AUXM_PU_PD) ; off-sheet TYPEC1_SBU2_DC
TYPEC1_TX1_N: U8.AK26(TYPEC1_TX1M) ; off-sheet TYPEC1_TX1_N
TYPEC1_TX1_P: U8.AL26(TYPEC1_TX1P) ; off-sheet TYPEC1_TX1_P
TYPEC1_TX2_N: U8.AK28(TYPEC1_TX2M) ; off-sheet TYPEC1_TX2_N
TYPEC1_TX2_P: U8.AL28(TYPEC1_TX2P) ; off-sheet TYPEC1_TX2_P
TYPEC1_U2VBUSDET: R38.2 ; off-sheet TYPEC1_U2VBUSDET
NetD2_K: D2.K R36.1 U8.AK30(TYPEC0_U2VBUSDET)
NetD3_K: D3.K R38.1 U8.AK31(TYPEC1_U2VBUSDET)
NetR32_1: R32.1 U8.AG18(TYPEC0_REXT)
NetR33_1: R33.1 U8.AE21(TYPEC1_REXT)
NetR34_1: R34.1 U8.AG21(TYPEC1_REXT_CC)
NetR35_1: R35.1 U8.AG20(TYPEC0_REXT_CC)
NetR37_1: R37.1 U8.AC31(USB0_RBIAS)
NetR39_1: R39.1 U8.AC30(USB1_RBIAS)

Not connected (* = marked no-connect by the designer): U8 AC19(TYPEC1_U3VBUSDET)* AD18(TYPEC0_RCLKM)* AD19(TYPEC0_U3VBUSDET)* AD20(TYPEC1_RCLKM)* AD24(USIC_AVDD_1V2)* AD25(USIC_AVDD_0V9)* AE18(TYPEC0_RCLKP)* AE20(TYPEC1_RCLKP)* AE26(TYPEC1_ID)* AF21(TYPEC1_CC2)* AH18(TYPEC0_CC1)* AH20(TYPEC0_CC2)* AH21(TYPEC1_CC1)* AJ30(USIC_STROBE)* AJ31(USIC_DATA)* AL30(TYPEC0_ID)*

### Layout directives
differential pair: HOST0_D_N, HOST0_D_P, HOST1_D_N, HOST1_D_P, TYPEC0_D_N, TYPEC0_D_P, TYPEC0_RX1_N, TYPEC0_RX1_P, TYPEC0_RX2_N, TYPEC0_RX2_P, TYPEC0_TX1_N, TYPEC0_TX1_P, TYPEC0_TX2_N, TYPEC0_TX2_P, TYPEC1_D_N, TYPEC1_D_P, TYPEC1_RX1_N, TYPEC1_RX1_P, TYPEC1_RX2_N, TYPEC1_RX2_P, TYPEC1_TX1_N, TYPEC1_TX1_P, TYPEC1_TX2_N, TYPEC1_TX2_P
mark named 90_OHM_DIFF: HOST0_D_N, HOST0_D_P, HOST1_D_N, HOST1_D_P, TYPEC0_D_N, TYPEC0_D_P, TYPEC0_RX1_N, TYPEC0_RX1_P, TYPEC0_RX2_N, TYPEC0_RX2_P, TYPEC0_TX1_N, TYPEC0_TX1_P, TYPEC0_TX2_N, TYPEC0_TX2_P, TYPEC1_D_N, TYPEC1_D_P, TYPEC1_RX1_N, TYPEC1_RX1_P, TYPEC1_RX2_N, TYPEC1_RX2_P, TYPEC1_TX1_N, TYPEC1_TX1_P, TYPEC1_TX2_N, TYPEC1_TX2_P
mark named 90_OHM: GND, TYPEC0_SBU1_DC_N, TYPEC0_SBU1_DC_P, TYPEC0_SBU1_N, TYPEC0_SBU1_P, TYPEC1_SBU1, TYPEC1_SBU1_DC, TYPEC1_SBU2, TYPEC1_SBU2_DC

### Notes on the sheet
- USB2
- Decoupling Capacitors
- USIC
- Title
- Size:
- Date:
- B
- Number:
- Time:
- Revision:
- Sheet
- of
- File:

### Library data of the parts
C210-C218 = CAP_100nF-25V-10%-0201: as C187-C190 on sheet [4] RK3399_EMMC_ADC_PCIE; Case/Package: 0201; Supplier-1: Digikey
D2 D3 = DIO-Z_3.3V-300mW-SOD-523: as D1 on sheet [5] RK3399_EDP_CSI_HDMI; Manufacturer Part Number: BZT52C3V3T-7; Case/Package: SOD523; Supplier-1: Digikey
R32-R35 = RES_499R-0.05W-1%-0201: 499 Ohms ±1% 0.05W, 1/20W Chip Resistor 0201 (0603 Metric) Thick Film /; Manufacturer: Stackpole Electronics Inc; Manufacturer Part Number: RMCF0201FT499R; Case/Package: 0201; Supplier-1: Digikey
R36 R38 = RES_1K-0.05W-1%-0201: 1 kOhms ±1% 0.05W, 1/20W Chip Resistor 0201 (0603 Metric) Thick Film /; Manufacturer: Yageo; Manufacturer Part Number: RC0201FR-071KL; Case/Package: 0201; Supplier-1: Digikey
R37 R39 = RES_133R-0.05W-1%-0201: 133 Ohms ±1% 0.05W, 1/20W Chip Resistor 0201 (0603 Metric) Automotive AEC-Q200 Thick Film /; Manufacturer: Panasonic Electronic Components; Manufacturer Part Number: ERJ-1GNF1330C; Case/Package: 0201; Supplier-1: Digikey
U8 = IC_RK3399-FCBGA828: as U8 on sheet [4] RK3399_EMMC_ADC_PCIE; Manufacturer Part Number: RK3399; Case/Package: FCBGA828; Supplier-1: Rockchip

## Sheet [7] RK3399_MIPI-CSI_I2C.SchDoc: RK3399, MIPI-CSI and I2C
size B; DocumentNumber: I; Revision: 01; SheetNumber: 7; SheetTotal: 19
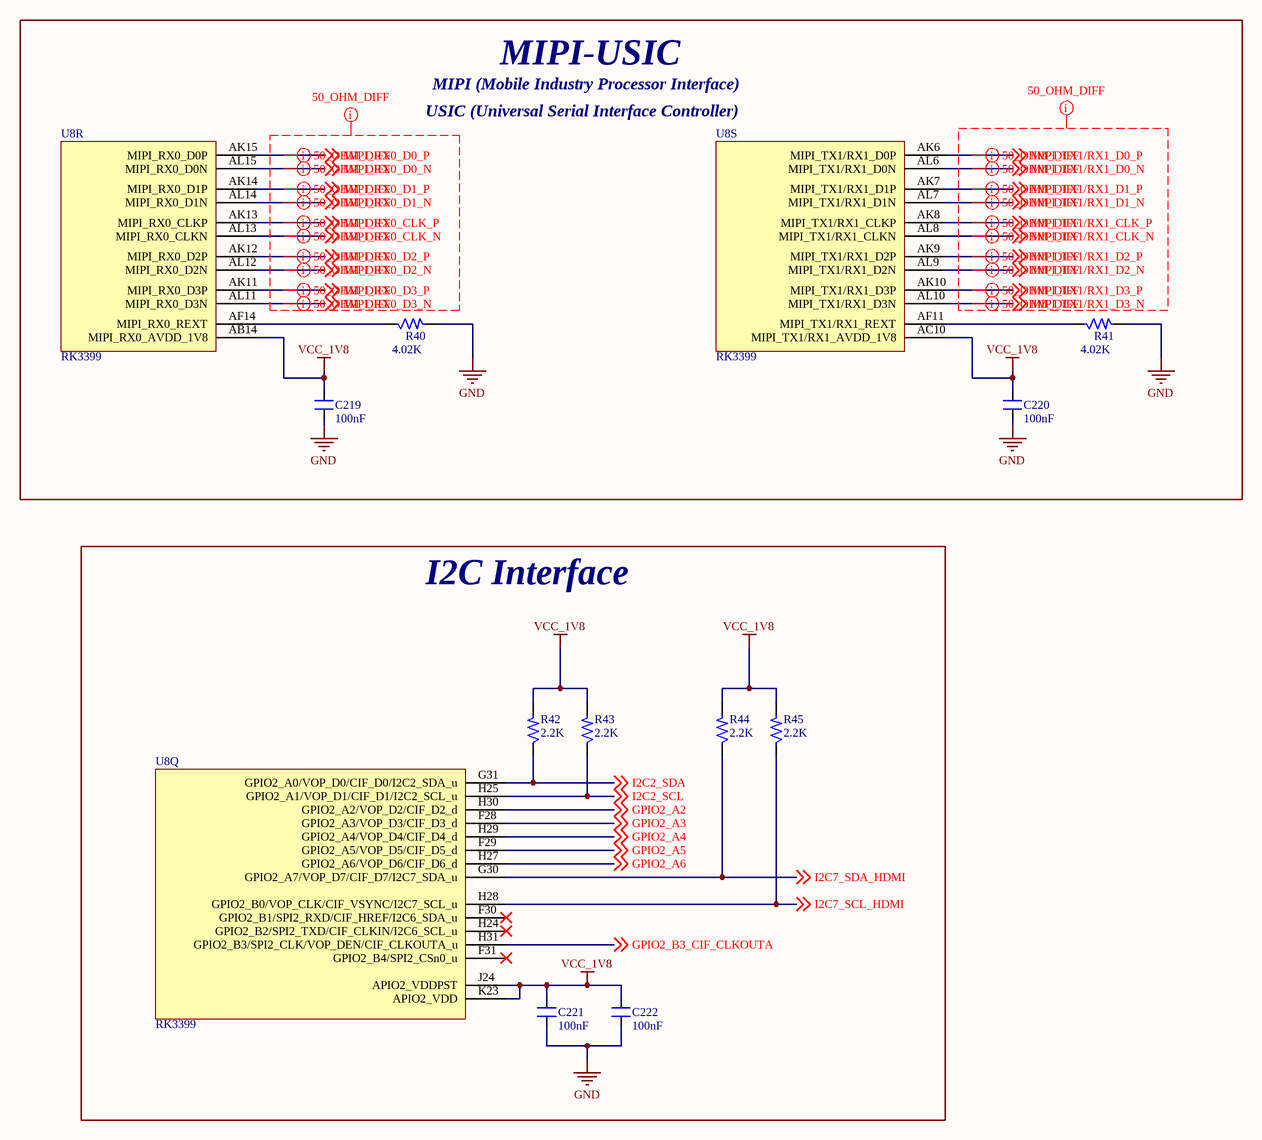
[diagram p10: [7] RK3399_MIPI-CSI_I2C.SchDoc]

### Parts
C219  100nF  [CAP_0201]
C220  100nF  [CAP_0201]
C221  100nF  [CAP_0201]
C222  100nF  [CAP_0201]
R40  4.02K  [RES_0201]
R41  4.02K  [RES_0201]
R42  2.2K  [RES_0201]
R43  2.2K  [RES_0201]
R44  2.2K  [RES_0201]
R45  2.2K  [RES_0201]
U8  RK3399  [FBGA828_23_826X826]  (parts Q,R,S of 24)

### Blocks framed on the sheet
MIPI-USIC: C219 C220 R40 R41 U8
I2C Interface: C221 C222 R42-R45 U8

### Nets
GND: C219.1 C220.1 C221.1 C222.1 R40.2 R41.2
VCC_1V8: C219.2 C220.2 C221.2 C222.2 R42.2 R43.2 R44.2 R45.2 U8.AB14(MIPI_RX0_AVDD_1V8) U8.AC10(MIPI_TX1/RX1_AVDD_1V8) U8.J24(APIO2_VDDPST) U8.K23(APIO2_VDD)  [project net EDP_AVDD_1V8]
GPIO2_A2: U8.H30(GPIO2_A2/VOP_D2/CIF_D2_d) ; off-sheet GPIO2_A2
GPIO2_A3: U8.F28(GPIO2_A3/VOP_D3/CIF_D3_d) ; off-sheet GPIO2_A3
GPIO2_A4: U8.H29(GPIO2_A4/VOP_D4/CIF_D4_d) ; off-sheet GPIO2_A4
GPIO2_A5: U8.F29(GPIO2_A5/VOP_D5/CIF_D5_d) ; off-sheet GPIO2_A5
GPIO2_A6: U8.H27(GPIO2_A6/VOP_D6/CIF_D6_d) ; off-sheet GPIO2_A6
GPIO2_B3_CIF_CLKOUTA: U8.H31(GPIO2_B3/SPI2_CLK/VOP_DEN/CIF_CLKOUTA_u) ; off-sheet GPIO2_B3_CIF_CLKOUTA
I2C2_SCL: R43.1 U8.H25(GPIO2_A1/VOP_D1/CIF_D1/I2C2_SCL_u) ; off-sheet I2C2_SCL
I2C2_SDA: R42.1 U8.G31(GPIO2_A0/VOP_D0/CIF_D0/I2C2_SDA_u) ; off-sheet I2C2_SDA
I2C7_SCL_HDMI: R45.1 U8.H28(GPIO2_B0/VOP_CLK/CIF_VSYNC/I2C7_SCL_u) ; off-sheet I2C7_SCL_HDMI
I2C7_SDA_HDMI: R44.1 U8.G30(GPIO2_A7/VOP_D7/CIF_D7/I2C7_SDA_u) ; off-sheet I2C7_SDA_HDMI
MIPI_RX0_CLK_N: U8.AL13(MIPI_RX0_CLKN) ; off-sheet MIPI_RX0_CLK_N
MIPI_RX0_CLK_P: U8.AK13(MIPI_RX0_CLKP) ; off-sheet MIPI_RX0_CLK_P
MIPI_RX0_D0_N: U8.AL15(MIPI_RX0_D0N) ; off-sheet MIPI_RX0_D0_N
MIPI_RX0_D0_P: U8.AK15(MIPI_RX0_D0P) ; off-sheet MIPI_RX0_D0_P
MIPI_RX0_D1_N: U8.AL14(MIPI_RX0_D1N) ; off-sheet MIPI_RX0_D1_N
MIPI_RX0_D1_P: U8.AK14(MIPI_RX0_D1P) ; off-sheet MIPI_RX0_D1_P
MIPI_RX0_D2_N: U8.AL12(MIPI_RX0_D2N) ; off-sheet MIPI_RX0_D2_N
MIPI_RX0_D2_P: U8.AK12(MIPI_RX0_D2P) ; off-sheet MIPI_RX0_D2_P
MIPI_RX0_D3_N: U8.AL11(MIPI_RX0_D3N) ; off-sheet MIPI_RX0_D3_N
MIPI_RX0_D3_P: U8.AK11(MIPI_RX0_D3P) ; off-sheet MIPI_RX0_D3_P
MIPI_TX1/RX1_CLK_N: U8.AL8(MIPI_TX1/RX1_CLKN) ; off-sheet MIPI_TX1/RX1_CLK_N
MIPI_TX1/RX1_CLK_P: U8.AK8(MIPI_TX1/RX1_CLKP) ; off-sheet MIPI_TX1/RX1_CLK_P
MIPI_TX1/RX1_D0_N: U8.AL6(MIPI_TX1/RX1_D0N) ; off-sheet MIPI_TX1/RX1_D0_N
MIPI_TX1/RX1_D0_P: U8.AK6(MIPI_TX1/RX1_D0P) ; off-sheet MIPI_TX1/RX1_D0_P
MIPI_TX1/RX1_D1_N: U8.AL7(MIPI_TX1/RX1_D1N) ; off-sheet MIPI_TX1/RX1_D1_N
MIPI_TX1/RX1_D1_P: U8.AK7(MIPI_TX1/RX1_D1P) ; off-sheet MIPI_TX1/RX1_D1_P
MIPI_TX1/RX1_D2_N: U8.AL9(MIPI_TX1/RX1_D2N) ; off-sheet MIPI_TX1/RX1_D2_N
MIPI_TX1/RX1_D2_P: U8.AK9(MIPI_TX1/RX1_D2P) ; off-sheet MIPI_TX1/RX1_D2_P
MIPI_TX1/RX1_D3_N: U8.AL10(MIPI_TX1/RX1_D3N) ; off-sheet MIPI_TX1/RX1_D3_N
MIPI_TX1/RX1_D3_P: U8.AK10(MIPI_TX1/RX1_D3P) ; off-sheet MIPI_TX1/RX1_D3_P
NetR40_1: R40.1 U8.AF14(MIPI_RX0_REXT)
NetR41_1: R41.1 U8.AF11(MIPI_TX1/RX1_REXT)

Not connected (* = marked no-connect by the designer): U8 F30(GPIO2_B1/SPI2_RXD/CIF_HREF/I2C6_SDA_u)* F31(GPIO2_B4/SPI2_CSn0_u)* H24(GPIO2_B2/SPI2_TXD/CIF_CLKIN/I2C6_SCL_u)*

### Layout directives
differential pair: MIPI_RX0_CLK_N, MIPI_RX0_CLK_P, MIPI_RX0_D0_N, MIPI_RX0_D0_P, MIPI_RX0_D1_N, MIPI_RX0_D1_P, MIPI_RX0_D2_N, MIPI_RX0_D2_P, MIPI_RX0_D3_N, MIPI_RX0_D3_P, MIPI_TX1/RX1_CLK_N, MIPI_TX1/RX1_CLK_P, MIPI_TX1/RX1_D0_N, MIPI_TX1/RX1_D0_P, MIPI_TX1/RX1_D1_N, MIPI_TX1/RX1_D1_P, MIPI_TX1/RX1_D2_N, MIPI_TX1/RX1_D2_P, MIPI_TX1/RX1_D3_N, MIPI_TX1/RX1_D3_P
mark named 50_OHM_DIFF: MIPI_RX0_CLK_N, MIPI_RX0_CLK_P, MIPI_RX0_D0_N, MIPI_RX0_D0_P, MIPI_RX0_D1_N, MIPI_RX0_D1_P, MIPI_RX0_D2_N, MIPI_RX0_D2_P, MIPI_RX0_D3_N, MIPI_RX0_D3_P, MIPI_TX1/RX1_CLK_N, MIPI_TX1/RX1_CLK_P, MIPI_TX1/RX1_D0_N, MIPI_TX1/RX1_D0_P, MIPI_TX1/RX1_D1_N, MIPI_TX1/RX1_D1_P, MIPI_TX1/RX1_D2_N, MIPI_TX1/RX1_D2_P, MIPI_TX1/RX1_D3_N, MIPI_TX1/RX1_D3_P

### Notes on the sheet
- MIPI (Mobile Industry Processor Interface)
- USIC (Universal Serial Interface Controller)
- Title
- Size:
- Date:
- B
- Number:
- Time:
- Revision:
- Sheet
- of
- File:

### Library data of the parts
C219-C222 = CAP_100nF-25V-10%-0201: as C187-C190 on sheet [4] RK3399_EMMC_ADC_PCIE; Case/Package: 0201; Supplier-1: Digikey
R40 R41 = RES_4.02K-0.05W-1%-0201: as R31 on sheet [5] RK3399_EDP_CSI_HDMI; Case/Package: 0201; Supplier-1: Digikey
R42-R45 = RES_2.2K-0.05W-1%-0201: 2.2 kOhms ±1% 0.05W, 1/20W Chip Resistor 0201 (0603 Metric) Thick Film /; Manufacturer: Stackpole Electronics Inc; Manufacturer Part Number: RMCF0201FT2K20; Case/Package: 0201; Supplier-1: Digikey
U8 = IC_RK3399-FCBGA828: as U8 on sheet [4] RK3399_EMMC_ADC_PCIE; Manufacturer Part Number: RK3399; Case/Package: FCBGA828; Supplier-1: Rockchip

## Sheet [8] RK3399_SDIO_SPI_GPIOs.SchDoc: RK3399, SDIO, SPI and GPIOs
size B; DocumentNumber: I; Revision: 01; SheetNumber: 8; SheetTotal: 19
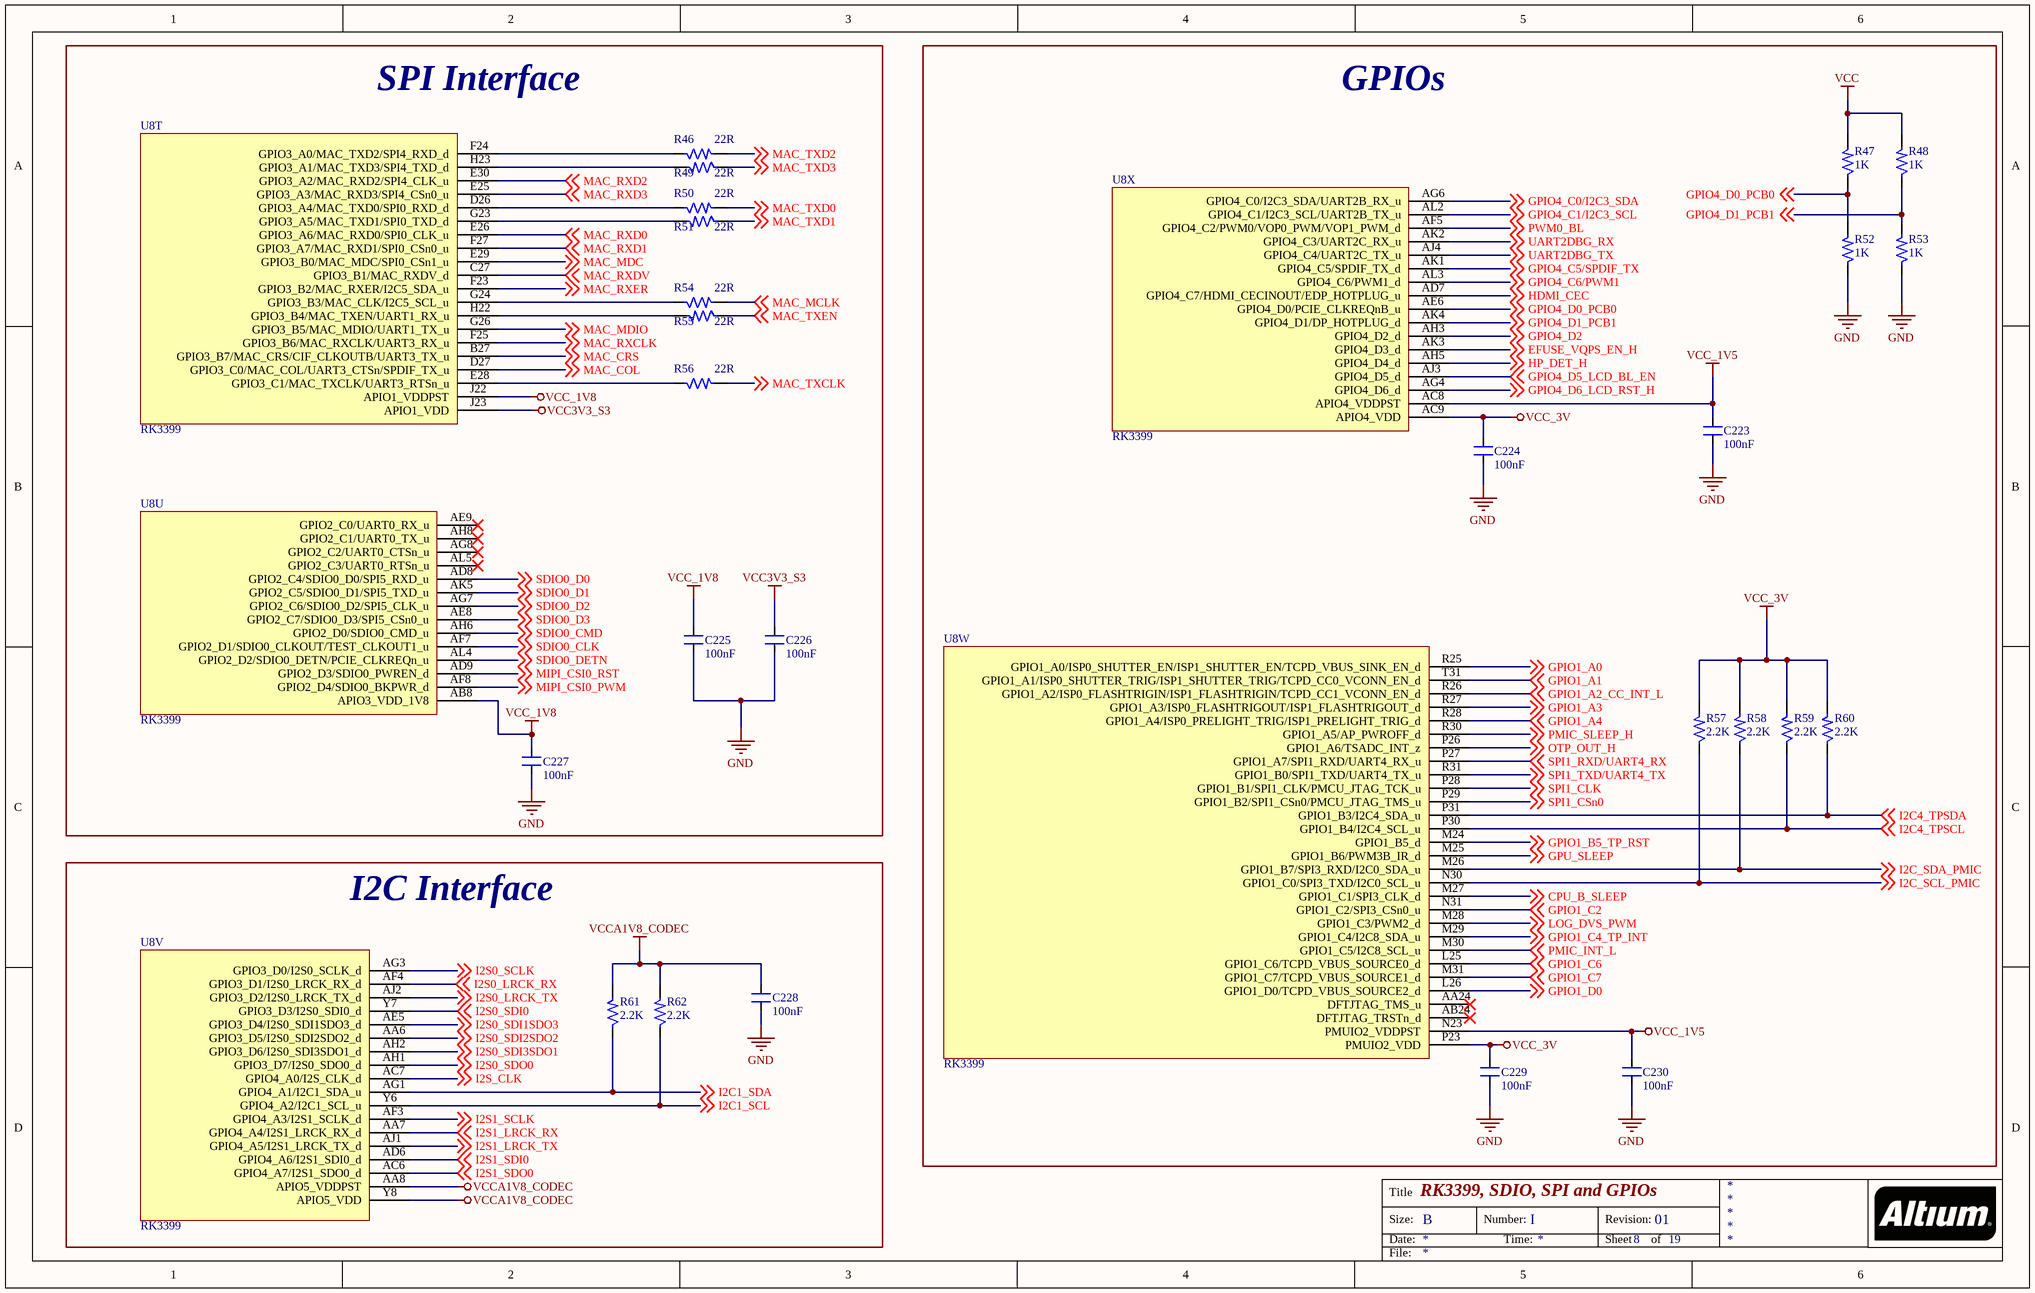
[diagram p11: [8] RK3399_SDIO_SPI_GPIOs.SchDoc]

### Parts
C223  100nF  [CAP_0201]
C224  100nF  [CAP_0201]
C225  100nF  [CAP_0201]
C226  100nF  [CAP_0201]
C227  100nF  [CAP_0201]
C228  100nF  [CAP_0201]
C229  100nF  [CAP_0201]
C230  100nF  [CAP_0201]
R46  22R  [RES_0201]
R47  1K  [RES_0201]
R48  1K  [RES_0201]
R49  22R  [RES_0201]
R50  22R  [RES_0201]
R51  22R  [RES_0201]
R52  1K  [RES_0402]
R53  1K  [RES_0402]
R54  22R  [RES_0201]
R55  22R  [RES_0201]
R56  22R  [RES_0201]
R57  2.2K  [RES_0201]
R58  2.2K  [RES_0201]
R59  2.2K  [RES_0201]
R60  2.2K  [RES_0201]
R61  2.2K  [RES_0201]
R62  2.2K  [RES_0201]
U8  RK3399  [FBGA828_23_826X826]  (parts T,U,V,W,X of 24)

### Blocks framed on the sheet
SPI Interface: C225-C227 R46 R49-R51 R54-R56 U8
GPIOs: C223 C224 C229 C230 R47 R48 R52 R53 R57-R60 U8
I2C Interface: C228 R61 R62 U8

### Nets
GND: C223.1 C224.1 C225.1 C226.1 C227.1 C228.1 C229.1 C230.1 R52.1 R53.1
VCC: R47.2 R48.2
VCC3V3_S3: C226.2 U8.J23(APIO1_VDD)  [project net VSOUT1]
VCC_1V5: C223.2 C230.2 U8.AC8(APIO4_VDDPST) U8.N23(PMUIO2_VDDPST)  [project net VLDO6]
VCC_1V8: C225.2 C227.2 U8.AB8(APIO3_VDD_1V8) U8.J22(APIO1_VDDPST)  [project net EDP_AVDD_1V8]
VCC_3V: C224.2 C229.2 R57.2 R58.2 R59.2 R60.2 U8.AC9(APIO4_VDD) U8.P23(PMUIO2_VDD)  [project net VLDO8]
VCCA1V8_CODEC: C228.2 R61.2 R62.2 U8.AA8(APIO5_VDDPST) U8.Y8(APIO5_VDD)  [project net VLDO7]
CPU_B_SLEEP: U8.M27(GPIO1_C1/SPI3_CLK_d) ; off-sheet CPU_B_SLEEP
EFUSE_VQPS_EN_H: U8.AK3(GPIO4_D3_d) ; off-sheet EFUSE_VQPS_EN_H
GPIO1_A0: U8.R25(GPIO1_A0/ISP0_SHUTTER_EN/ISP1_SHUTTER_EN/TCPD_VBUS_SINK_EN_d) ; off-sheet GPIO1_A0
GPIO1_A1: U8.T31(GPIO1_A1/ISP0_SHUTTER_TRIG/ISP1_SHUTTER_TRIG/TCPD_CC0_VCONN_EN_d) ; off-sheet GPIO1_A1
GPIO1_A2_CC_INT_L: U8.R26(GPIO1_A2/ISP0_FLASHTRIGIN/ISP1_FLASHTRIGIN/TCPD_CC1_VCONN_EN_d) ; off-sheet GPIO1_A2_CC_INT_L
GPIO1_A3: U8.R27(GPIO1_A3/ISP0_FLASHTRIGOUT/ISP1_FLASHTRIGOUT_d) ; off-sheet GPIO1_A3
GPIO1_A4: U8.R28(GPIO1_A4/ISP0_PRELIGHT_TRIG/ISP1_PRELIGHT_TRIG_d) ; off-sheet GPIO1_A4
GPIO1_B5_TP_RST: U8.M24(GPIO1_B5_d) ; off-sheet GPIO1_B5_TP_RST
GPIO1_C2: U8.N31(GPIO1_C2/SPI3_CSn0_u) ; off-sheet GPIO1_C2
GPIO1_C4_TP_INT: U8.M29(GPIO1_C4/I2C8_SDA_u) ; off-sheet GPIO1_C4_TP_INT
GPIO1_C6: U8.L25(GPIO1_C6/TCPD_VBUS_SOURCE0_d) ; off-sheet GPIO1_C6
GPIO1_C7: U8.M31(GPIO1_C7/TCPD_VBUS_SOURCE1_d) ; off-sheet GPIO1_C7
GPIO1_D0: U8.L26(GPIO1_D0/TCPD_VBUS_SOURCE2_d) ; off-sheet GPIO1_D0
GPIO4_C0/I2C3_SDA: U8.AG6(GPIO4_C0/I2C3_SDA/UART2B_RX_u) ; off-sheet GPIO4_C0/I2C3_SDA
GPIO4_C1/I2C3_SCL: U8.AL2(GPIO4_C1/I2C3_SCL/UART2B_TX_u) ; off-sheet GPIO4_C1/I2C3_SCL
GPIO4_C5/SPDIF_TX: U8.AK1(GPIO4_C5/SPDIF_TX_d) ; off-sheet GPIO4_C5/SPDIF_TX
GPIO4_C6/PWM1: U8.AL3(GPIO4_C6/PWM1_d) ; off-sheet GPIO4_C6/PWM1
GPIO4_D0_PCB0: R47.1 R52.2 U8.AE6(GPIO4_D0/PCIE_CLKREQnB_u) ; off-sheet GPIO4_D0_PCB0
GPIO4_D1_PCB1: R48.1 R53.2 U8.AK4(GPIO4_D1/DP_HOTPLUG_d) ; off-sheet GPIO4_D1_PCB1
GPIO4_D2: U8.AH3(GPIO4_D2_d) ; off-sheet GPIO4_D2
GPIO4_D5_LCD_BL_EN: U8.AJ3(GPIO4_D5_d) ; off-sheet GPIO4_D5_LCD_BL_EN
GPIO4_D6_LCD_RST_H: U8.AG4(GPIO4_D6_d) ; off-sheet GPIO4_D6_LCD_RST_H
GPU_SLEEP: U8.M25(GPIO1_B6/PWM3B_IR_d) ; off-sheet GPU_SLEEP
HDMI_CEC: U8.AD7(GPIO4_C7/HDMI_CECINOUT/EDP_HOTPLUG_u) ; off-sheet HDMI_CEC
HP_DET_H: U8.AH5(GPIO4_D4_d) ; off-sheet HP_DET_H
I2C1_SCL: R62.1 U8.Y6(GPIO4_A2/I2C1_SCL_u) ; off-sheet I2C1_SCL
I2C1_SDA: R61.1 U8.AG1(GPIO4_A1/I2C1_SDA_u) ; off-sheet I2C1_SDA
I2C4_TPSCL: R59.1 U8.P30(GPIO1_B4/I2C4_SCL_u) ; off-sheet I2C4_TPSCL
I2C4_TPSDA: R60.1 U8.P31(GPIO1_B3/I2C4_SDA_u) ; off-sheet I2C4_TPSDA
I2C_SCL_PMIC: R57.1 U8.N30(GPIO1_C0/SPI3_TXD/I2C0_SCL_u) ; off-sheet I2C_SCL_PMIC
I2C_SDA_PMIC: R58.1 U8.M26(GPIO1_B7/SPI3_RXD/I2C0_SDA_u) ; off-sheet I2C_SDA_PMIC
I2S0_LRCK_RX: U8.AF4(GPIO3_D1/I2S0_LRCK_RX_d) ; off-sheet I2S0_LRCK_RX
I2S0_LRCK_TX: U8.AJ2(GPIO3_D2/I2S0_LRCK_TX_d) ; off-sheet I2S0_LRCK_TX
I2S0_SCLK: U8.AG3(GPIO3_D0/I2S0_SCLK_d) ; off-sheet I2S0_SCLK
I2S0_SDI0: U8.Y7(GPIO3_D3/I2S0_SDI0_d) ; off-sheet I2S0_SDI0
I2S0_SDI1SDO3: U8.AE5(GPIO3_D4/I2S0_SDI1SDO3_d) ; off-sheet I2S0_SDI1SDO3
I2S0_SDI2SDO2: U8.AA6(GPIO3_D5/I2S0_SDI2SDO2_d) ; off-sheet I2S0_SDI2SDO2
I2S0_SDI3SDO1: U8.AH2(GPIO3_D6/I2S0_SDI3SDO1_d) ; off-sheet I2S0_SDI3SDO1
I2S0_SDO0: U8.AH1(GPIO3_D7/I2S0_SDO0_d) ; off-sheet I2S0_SDO0
I2S1_LRCK_RX: U8.AA7(GPIO4_A4/I2S1_LRCK_RX_d) ; off-sheet I2S1_LRCK_RX
I2S1_LRCK_TX: U8.AJ1(GPIO4_A5/I2S1_LRCK_TX_d) ; off-sheet I2S1_LRCK_TX
I2S1_SCLK: U8.AF3(GPIO4_A3/I2S1_SCLK_d) ; off-sheet I2S1_SCLK
I2S1_SDI0: U8.AD6(GPIO4_A6/I2S1_SDI0_d) ; off-sheet I2S1_SDI0
I2S1_SDO0: U8.AC6(GPIO4_A7/I2S1_SDO0_d) ; off-sheet I2S1_SDO0
I2S_CLK: U8.AC7(GPIO4_A0/I2S_CLK_d) ; off-sheet I2S_CLK
LOG_DVS_PWM: U8.M28(GPIO1_C3/PWM2_d) ; off-sheet LOG_DVS_PWM
MAC_COL: U8.D27(GPIO3_C0/MAC_COL/UART3_CTSn/SPDIF_TX_u) ; off-sheet MAC_COL
MAC_CRS: U8.B27(GPIO3_B7/MAC_CRS/CIF_CLKOUTB/UART3_TX_u) ; off-sheet MAC_CRS
MAC_MCLK: R54.2 ; off-sheet MAC_MCLK
MAC_MDC: U8.E29(GPIO3_B0/MAC_MDC/SPI0_CSn1_u) ; off-sheet MAC_MDC
MAC_MDIO: U8.G26(GPIO3_B5/MAC_MDIO/UART1_TX_u) ; off-sheet MAC_MDIO
MAC_RXCLK: U8.F25(GPIO3_B6/MAC_RXCLK/UART3_RX_u) ; off-sheet MAC_RXCLK
MAC_RXD0: U8.E26(GPIO3_A6/MAC_RXD0/SPI0_CLK_u) ; off-sheet MAC_RXD0
MAC_RXD1: U8.F27(GPIO3_A7/MAC_RXD1/SPI0_CSn0_u) ; off-sheet MAC_RXD1
MAC_RXD2: U8.E30(GPIO3_A2/MAC_RXD2/SPI4_CLK_u) ; off-sheet MAC_RXD2
MAC_RXD3: U8.E25(GPIO3_A3/MAC_RXD3/SPI4_CSn0_u) ; off-sheet MAC_RXD3
MAC_RXDV: U8.C27(GPIO3_B1/MAC_RXDV_d) ; off-sheet MAC_RXDV
MAC_RXER: U8.F23(GPIO3_B2/MAC_RXER/I2C5_SDA_u) ; off-sheet MAC_RXER
MAC_TXCLK: R56.2 ; off-sheet MAC_TXCLK
MAC_TXD0: R50.2 ; off-sheet MAC_TXD0
MAC_TXD1: R51.1 ; off-sheet MAC_TXD1
MAC_TXD2: R46.2 ; off-sheet MAC_TXD2
MAC_TXD3: R49.1 ; off-sheet MAC_TXD3
MAC_TXEN: R55.1 ; off-sheet MAC_TXEN
MIPI_CSI0_PWM: U8.AF8(GPIO2_D4/SDIO0_BKPWR_d) ; off-sheet MIPI_CSI0_PWM
MIPI_CSI0_RST: U8.AD9(GPIO2_D3/SDIO0_PWREN_d) ; off-sheet MIPI_CSI0_RST
OTP_OUT_H: U8.P26(GPIO1_A6/TSADC_INT_z) ; off-sheet OTP_OUT_H
PMIC_INT_L: U8.M30(GPIO1_C5/I2C8_SCL_u) ; off-sheet PMIC_INT_L
PMIC_SLEEP_H: U8.R30(GPIO1_A5/AP_PWROFF_d) ; off-sheet PMIC_SLEEP_H
PWM0_BL: U8.AF5(GPIO4_C2/PWM0/VOP0_PWM/VOP1_PWM_d) ; off-sheet PWM0_BL
SDIO0_CLK: U8.AF7(GPIO2_D1/SDIO0_CLKOUT/TEST_CLKOUT1_u) ; off-sheet SDIO0_CLK
SDIO0_CMD: U8.AH6(GPIO2_D0/SDIO0_CMD_u) ; off-sheet SDIO0_CMD
SDIO0_D0: U8.AD8(GPIO2_C4/SDIO0_D0/SPI5_RXD_u) ; off-sheet SDIO0_D0
SDIO0_D1: U8.AK5(GPIO2_C5/SDIO0_D1/SPI5_TXD_u) ; off-sheet SDIO0_D1
SDIO0_D2: U8.AG7(GPIO2_C6/SDIO0_D2/SPI5_CLK_u) ; off-sheet SDIO0_D2
SDIO0_D3: U8.AE8(GPIO2_C7/SDIO0_D3/SPI5_CSn0_u) ; off-sheet SDIO0_D3
SDIO0_DETN: U8.AL4(GPIO2_D2/SDIO0_DETN/PCIE_CLKREQn_u) ; off-sheet SDIO0_DETN
SPI1_CLK: U8.P28(GPIO1_B1/SPI1_CLK/PMCU_JTAG_TCK_u) ; off-sheet SPI1_CLK
SPI1_CSn0: U8.P29(GPIO1_B2/SPI1_CSn0/PMCU_JTAG_TMS_u) ; off-sheet SPI1_CSn0
SPI1_RXD/UART4_RX: U8.P27(GPIO1_A7/SPI1_RXD/UART4_RX_u) ; off-sheet SPI1_RXD/UART4_RX
SPI1_TXD/UART4_TX: U8.R31(GPIO1_B0/SPI1_TXD/UART4_TX_u) ; off-sheet SPI1_TXD/UART4_TX
UART2DBG_RX: U8.AK2(GPIO4_C3/UART2C_RX_u) ; off-sheet UART2DBG_RX
UART2DBG_TX: U8.AJ4(GPIO4_C4/UART2C_TX_u) ; off-sheet UART2DBG_TX
NetR46_1: R46.1 U8.F24(GPIO3_A0/MAC_TXD2/SPI4_RXD_d)
NetR49_2: R49.2 U8.H23(GPIO3_A1/MAC_TXD3/SPI4_TXD_d)
NetR50_1: R50.1 U8.D26(GPIO3_A4/MAC_TXD0/SPI0_RXD_d)
NetR51_2: R51.2 U8.G23(GPIO3_A5/MAC_TXD1/SPI0_TXD_d)
NetR54_1: R54.1 U8.G24(GPIO3_B3/MAC_CLK/I2C5_SCL_u)
NetR55_2: R55.2 U8.H22(GPIO3_B4/MAC_TXEN/UART1_RX_u)
NetR56_1: R56.1 U8.E28(GPIO3_C1/MAC_TXCLK/UART3_RTSn_u)

Not connected (* = marked no-connect by the designer): U8 AA24(DFTJTAG_TMS_u)* AB24(DFTJTAG_TRSTn_d)* AE9(GPIO2_C0/UART0_RX_u)* AG8(GPIO2_C2/UART0_CTSn_u)* AH8(GPIO2_C1/UART0_TX_u)* AL5(GPIO2_C3/UART0_RTSn_u)*

### Notes on the sheet
- Title
- Size:
- Date:
- B
- Number:
- Time:
- Revision:
- Sheet
- of
- File:

### Library data of the parts
C223-C230 = CAP_100nF-25V-10%-0201: as C187-C190 on sheet [4] RK3399_EMMC_ADC_PCIE; Case/Package: 0201; Supplier-1: Digikey
R46 R49-R51 R54-R56 = RES_22R-0.05W-1%-0201: as R25 on sheet [4] RK3399_EMMC_ADC_PCIE; Case/Package: 0201; Supplier-1: Digikey
R47 R48 = RES_1K-0.05W-1%-0201: as R36 on sheet [6] RK3399_USB2_USIC; Case/Package: 0201; Supplier-1: Digikey
R52 R53 = RES_1K-0.1W-1%-0402: 1 kOhms ±1% 0.1W, 1/10W Chip Resistor 0402 (1005 Metric) Anti-Sulfur Thin Film /; Manufacturer: Vishay Beyschlag/Draloric/BC Components; Manufacturer Part Number: MCS04020C1001FE000; Case/Package: 0402; Supplier-1: Digikey
R57-R62 = RES_2.2K-0.05W-1%-0201: as R42 on sheet [7] RK3399_MIPI-CSI_I2C; Case/Package: 0201; Supplier-1: Digikey
U8 = IC_RK3399-FCBGA828: as U8 on sheet [4] RK3399_EMMC_ADC_PCIE; Manufacturer Part Number: RK3399; Case/Package: FCBGA828; Supplier-1: Rockchip

## Sheet [13] TYPEC0_PROG.SchDoc: Type C Programmer
size B; DocumentNumber: I; Revision: 01; SheetNumber: 13; SheetTotal: 19
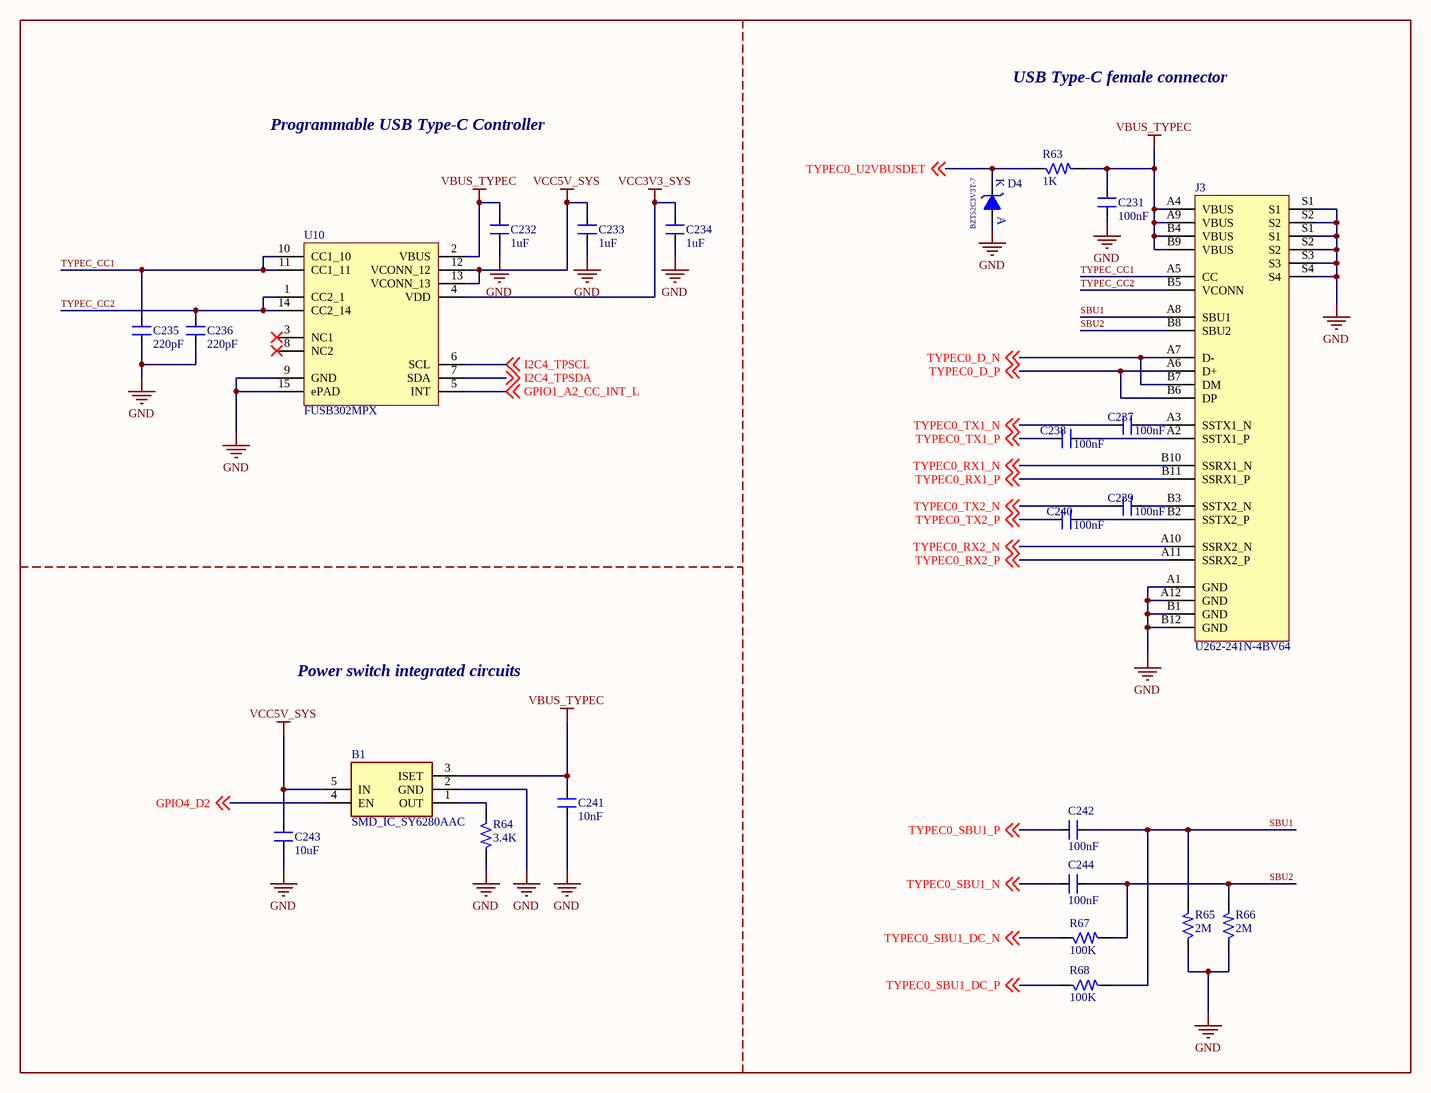
[diagram p12: [13] TYPEC0_PROG.SchDoc]

### Parts
B1  SMD_IC_SY6280AAC  [SOT95P285X140-5N]
C231  100nF  [CAP_0402]
C232  1uF  [CAP_0402]
C233  1uF  [CAP_0402]
C234  1uF  [CAP_0402]
C235  220pF  [CAP_0402]
C236  220pF  [CAP_0402]
C237  100nF  [CAP_0201]
C238  100nF  [CAP_0201]
C239  100nF  [CAP_0201]
C240  100nF  [CAP_0201]
C241  10nF  [CAP_0402]
C242  100nF  [CAP_0201]
C243  10uF  [CAP_0402]
C244  100nF  [CAP_0201]
D4  BZT52C3V3T-7  [DIO_SOD523]
J3  U262-241N-4BV64  [CON24_19.64_U262-241N-4BV64_TH_RA]
R63  1K  [RES_0402]
R64  3.4K  [RES_0402]
R65  2M  [RES_0201]
R66  2M  [RES_0201]
R67  100K  [RES_0201]
R68  100K  [RES_0201]
U10  FUSB302MPX  [MLP-14_98.4X98.4_SMD]

### Nets
GND: B1.2(GND) C231.1 C232.1 C233.2 C234.1 C235.1 C236.1 C241.1 C243.1 D4.A J3.A1(GND) J3.A12(GND) J3.B1(GND) J3.B12(GND) J3.S1 J3.S2 J3.S3 J3.S4 R64.2 R65.1 R66.1 U10.9(GND) U10.15(ePAD)
VBUS_TYPEC: B1.3(ISET) C231.2 C232.2 C241.2 J3.A4(VBUS) J3.A9(VBUS) J3.B4(VBUS) J3.B9(VBUS) R63.2 U10.2(VBUS)
VCC3V3_SYS: C234.2 U10.4(VDD)  [project net VCC7]
VCC5V_SYS: B1.5(IN) C233.1 C243.2 U10.12(VCONN_12) U10.13(VCONN_13)
GPIO1_A2_CC_INT_L: U10.5(INT) ; off-sheet GPIO1_A2_CC_INT_L
GPIO4_D2: B1.4(EN) ; off-sheet GPIO4_D2
I2C4_TPSCL: U10.6(SCL) ; off-sheet I2C4_TPSCL
I2C4_TPSDA: U10.7(SDA) ; off-sheet I2C4_TPSDA
SBU1: C242.2 J3.A8(SBU1) R65.2 R68.2
SBU2: C244.2 J3.B8(SBU2) R66.2 R67.2
TYPEC0_D_N: J3.A7(D-) J3.B7(DM) ; off-sheet TYPEC0_D_N
TYPEC0_D_P: J3.A6(D+) J3.B6(DP) ; off-sheet TYPEC0_D_P
TYPEC0_RX1_N: J3.B10(SSRX1_N) ; off-sheet TYPEC0_RX1_N
TYPEC0_RX1_P: J3.B11(SSRX1_P) ; off-sheet TYPEC0_RX1_P
TYPEC0_RX2_N: J3.A10(SSRX2_N) ; off-sheet TYPEC0_RX2_N
TYPEC0_RX2_P: J3.A11(SSRX2_P) ; off-sheet TYPEC0_RX2_P
TYPEC0_SBU1_DC_N: R67.1 ; off-sheet TYPEC0_SBU1_DC_N
TYPEC0_SBU1_DC_P: R68.1 ; off-sheet TYPEC0_SBU1_DC_P
TYPEC0_SBU1_N: C244.1 ; off-sheet TYPEC0_SBU1_N
TYPEC0_SBU1_P: C242.1 ; off-sheet TYPEC0_SBU1_P
TYPEC0_TX1_N: C237.1 ; off-sheet TYPEC0_TX1_N
TYPEC0_TX1_P: C238.1 ; off-sheet TYPEC0_TX1_P
TYPEC0_TX2_N: C239.1 ; off-sheet TYPEC0_TX2_N
TYPEC0_TX2_P: C240.1 ; off-sheet TYPEC0_TX2_P
TYPEC0_U2VBUSDET: D4.K R63.1 ; off-sheet TYPEC0_U2VBUSDET
TYPEC_CC1: C235.2 J3.A5(CC) U10.10(CC1_10) U10.11(CC1_11)
TYPEC_CC2: C236.2 J3.B5(VCONN) U10.1(CC2_1) U10.14(CC2_14)
NetB1_1: B1.1(OUT) R64.1
NetC237_2: C237.2 J3.A3(SSTX1_N)
NetC238_2: C238.2 J3.A2(SSTX1_P)
NetC239_2: C239.2 J3.B3(SSTX2_N)
NetC240_2: C240.2 J3.B2(SSTX2_P)

Not connected (* = marked no-connect by the designer): U10 3(NC1)* 8(NC2)*

### Notes on the sheet
- USB Type-C female connector
- Programmable USB Type-C Controller
- Power switch integrated circuits
- Title
- Size:
- Date:
- B
- Number:
- Time:
- Revision:
- Sheet
- of
- File:

### Library data of the parts
B1 = SMD_IC_SY6280AAC: Power Switch ICs - Power Distribution; Manufacturer_Name: Olimex Ltd.; Manufacturer_Part_Number: SMD IC SY6280AAC; Geometry.Height: 1.4mm; Mouser Part Number: 909-SMDICSY6280AAC; Mouser Price/Stock: https://www.mouser.co.uk/ProductDetail/Olimex-Ltd/SMD-IC-SY6280AAC?qs=9vOqFld9vZUuwGiRcx8i5w%3D%3D; Datasheet Link: *
C231 = CAP_100nF-25V-10%-0402: 0.1µF ±10% 25V Ceramic Capacitor X7R 0402 (1005 Metric) /; Manufacturer: Walsin Technology Corporation; Manufacturer Part Number: 0402B104K250CT; Case/Package: 0402; Supplier-1: Digikey
C232-C234 = CAP_1uF-10V-10%-0402: 1µF ±10% 10V Ceramic Capacitor X6S 0402 (1005 Metric) /; Manufacturer: Murata Electronics; Manufacturer Part Number: GRT155C81A105KE01D; Case/Package: 0402; Supplier-1: Digikey
C235 C236 = CAP_220pF-10V-10%-0402: 220pF ±10% 10V Ceramic Capacitor X7R 0402 (1005 Metric) /; Manufacturer: KEMET; Manufacturer Part Number: C0402C221K8RAC7867; Case/Package: 0402; Supplier-1: Digikey
C237-C240 C242 C244 = CAP_100nF-25V-10%-0201: as C187-C190 on sheet [4] RK3399_EMMC_ADC_PCIE; Case/Package: 0201; Supplier-1: Digikey
C241 = CAP_10nF-10V-10%-0402: 10000pF ±10% 10V Ceramic Capacitor X7R 0402 (1005 Metric) /; Manufacturer: AVX Corporation; Manufacturer Part Number: 0402ZC103KAT2A; Case/Package: 0402; Supplier-1: Digikey
C243 = CAP_10uF-10V-20%-0402: 10µF ±20% 10V Ceramic Capacitor X5R 0402 (1005 Metric) /; Manufacturer Part Number: CL05A106MP5NUNC; Manufacturer: Samsung Electro-Mechanics; Case/Package: 0402; Supplier-1: Digikey
D4 = DIO-Z_3.3V-300mW-SOD-523: as D1 on sheet [5] RK3399_EDP_CSI_HDMI; Manufacturer Part Number: BZT52C3V3T-7; Case/Package: SOD523; Supplier-1: Digikey
J3 = CON-TYPEC_U262-241N-4BV64-SMD: USB - Type C Female 24 SMD USB Connectors RoHS; Manufacturer: XKB Connectivity; Manufacturer Part Number: U262-241N-4BV64; Case/Package: SMD; Supplier-1: LCSC
R63 = RES_1K-0.1W-1%-0402: as R52 on sheet [8] RK3399_SDIO_SPI_GPIOs; Case/Package: 0402; Supplier-1: Digikey
R64 = RES_3.4K-0.1W-1%-0402: 3.4 kOhms ±1% 0.1W, 1/10W Chip Resistor 0402 (1005 Metric) Automotive AEC-Q200 Thick Film /; Manufacturer: Panasonic Electronic Components; Manufacturer Part Number: ERJ-2RKF3401X; Case/Package: 0402; Supplier-1: Digikey
R65 R66 = RES_2M-0.05W-1%-0201: 2 MOhms ±1% 0.05W, 1/20W Chip Resistor 0201 (0603 Metric) Thick Film /; Manufacturer: Yageo; Manufacturer Part Number: RC0201FR-072ML; Case/Package: 0201; Supplier-1: Digikey
R67 R68 = RES_100K-0.05W-1%-0201: 100 kOhms ±1% 0.05W, 1/20W Chip Resistor 0201 (0603 Metric) Automotive AEC-Q200 Thick Film /; Manufacturer: Panasonic Electronic Components; Manufacturer Part Number: ERJ-1GNF1003C; Case/Package: 0201; Supplier-1: Digikey
U10 = IC_FUSB302MPX: USB Controller USB 3.1 USB Interface 14-MLP (2.5x2.5); Manufacturer: ON Semiconductor; Manufacturer Part Number: FUSB302MPX; Case/Package: 14-MLP; Supplier-1: Digikey

## Sheet [14] Ethernet.SchDoc: Ethernet
size B; DocumentNumber: I; Revision: 01; SheetNumber: 14; SheetTotal: 19
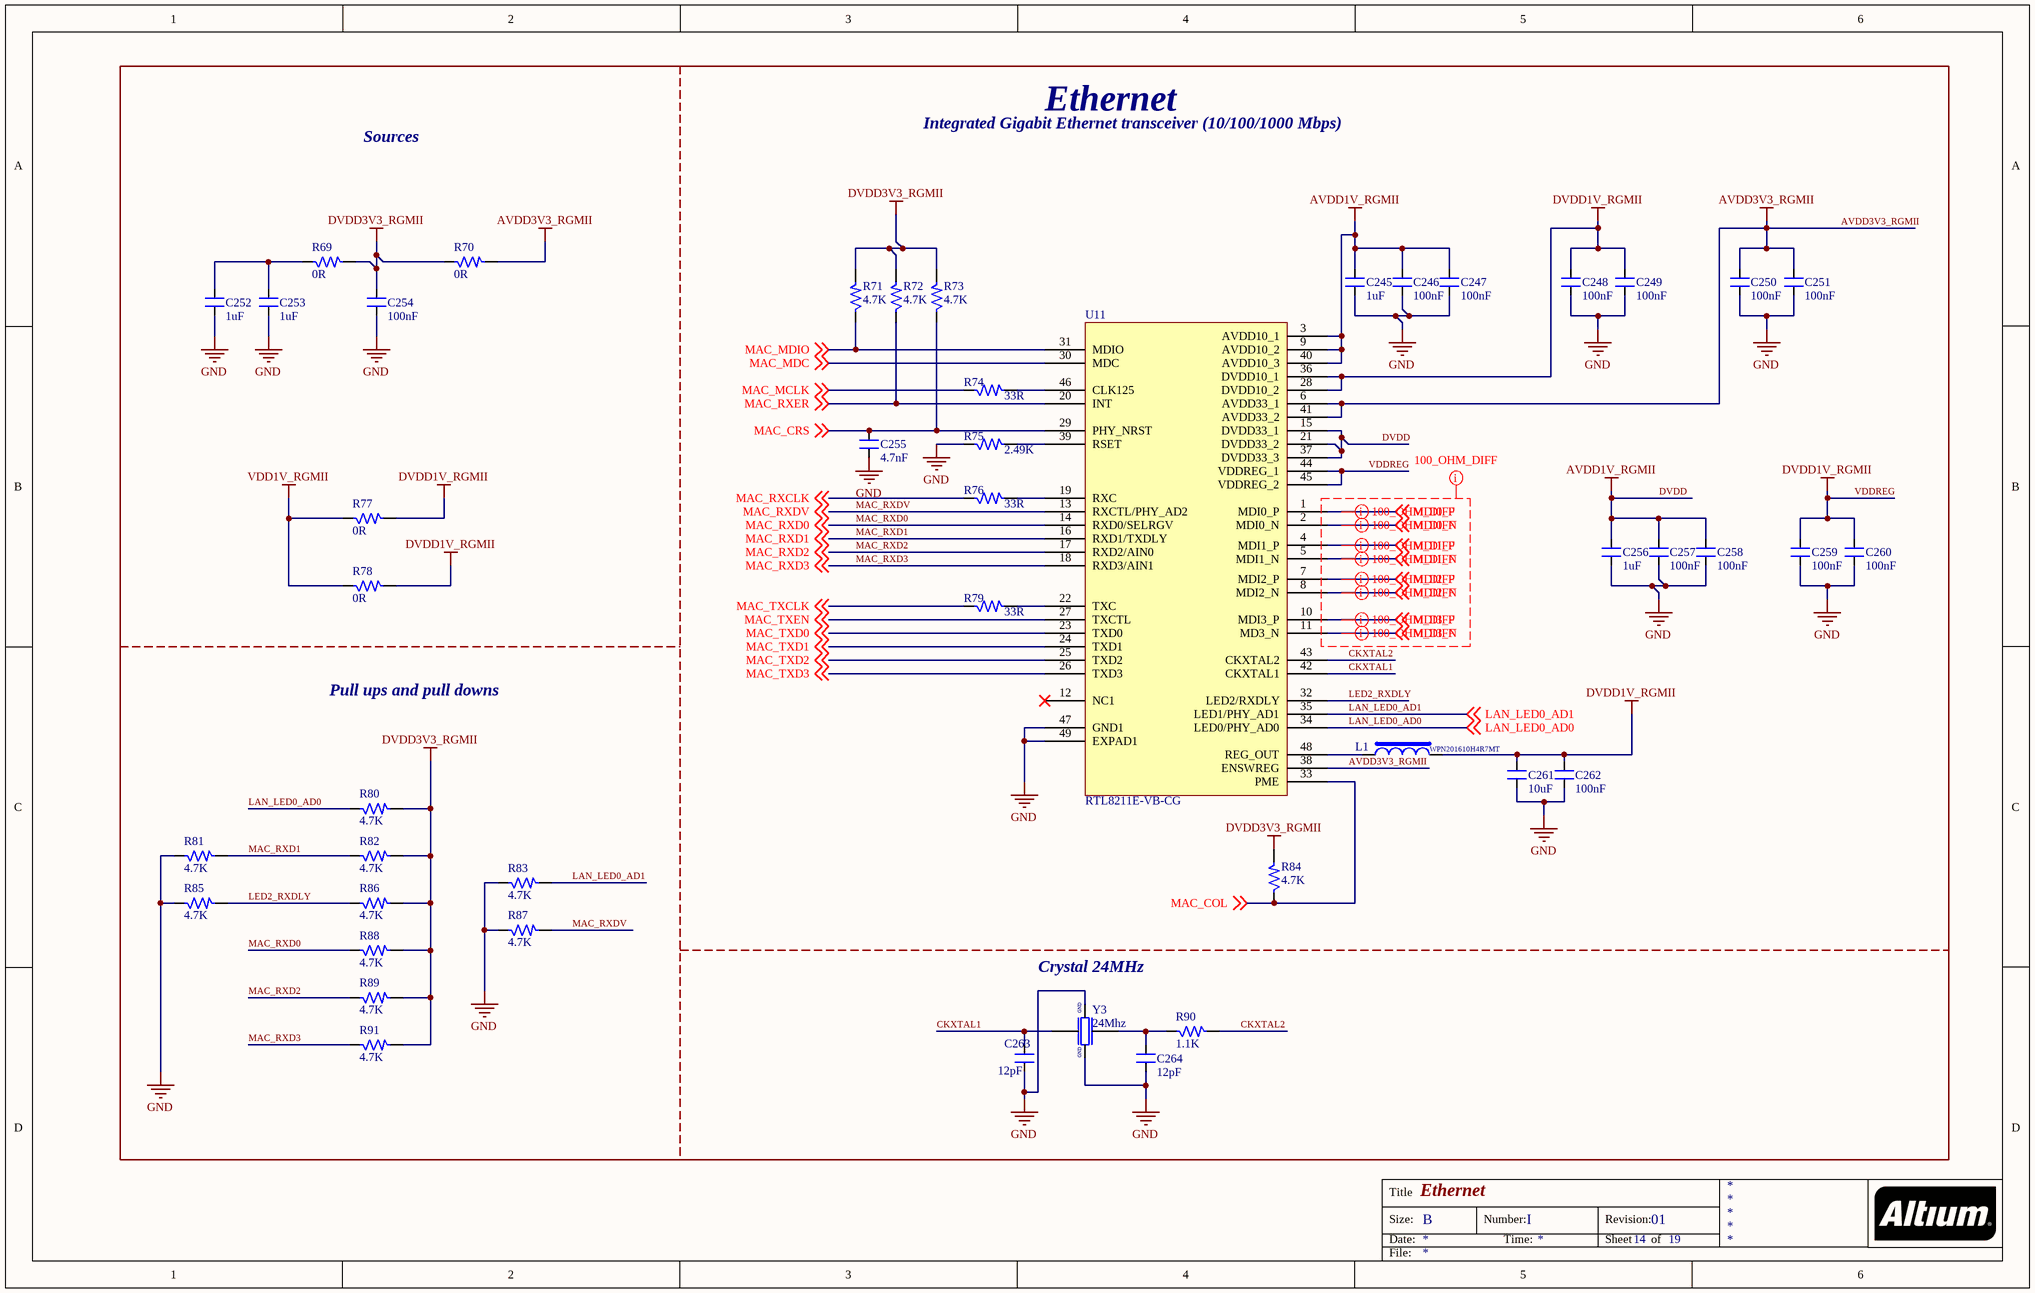
[diagram p13: [14] Ethernet.SchDoc]

### Parts
C245  1uF  [CAP_0201]
C246  100nF  [CAP_0201]
C247  100nF  [CAP_0201]
C248  100nF  [CAP_0201]
C249  100nF  [CAP_0201]
C250  100nF  [CAP_0201]
C251  100nF  [CAP_0201]
C252  1uF  [CAP_0402]
C253  1uF  [CAP_0402]
C254  100nF  [CAP_0201]
C255  4.7nF  [CAP_0201]
C256  1uF  [CAP_0201]
C257  100nF  [CAP_0201]
C258  100nF  [CAP_0201]
C259  100nF  [CAP_0201]
C260  100nF  [CAP_0201]
C261  10uF  [CAP_0402]
C262  100nF  [CAP_0201]
C263  12pF  [CAP_0402]
C264  12pF  [CAP_0402]
L1  WPN201610H4R7MT  [IND_62.9_110X86.6_SMD]
R69  0R  [RES_0201]
R70  0R  [RES_0201]
R71  4.7K  [RES_0201]
R72  4.7K  [RES_0201]
R73  4.7K  [RES_0201]
R74  33R  [RES_0201]
R75  2.49K  [RES_0201]
R76  33R  [RES_0201]
R77  0R  [RES_0201]
R78  0R  [RES_0201]
R79  33R  [RES_0201]
R80  4.7K  [RES_0201]
R81  4.7K  [RES_0201]
R82  4.7K  [RES_0201]
R83  4.7K  [RES_0201]
R84  4.7K  [RES_0201]
R85  4.7K  [RES_0201]
R86  4.7K  [RES_0201]
R87  4.7K  [RES_0201]
R88  4.7K  [RES_0201]
R89  4.7K  [RES_0201]
R90  1.1K  [RES_0201]
R91  4.7K  [RES_0201]
U11  RTL8211E-VB-CG  [QFN48_19.6_324X324_SMD]
Y3  24Mhz  [XTAL_ABM8AIG-24.000MHZ-12-2Z-T3]

### Nets
AVDD3V3_RGMII: C250.2 C251.2 R70.2 U11.6(AVDD33_1) U11.38(ENSWREG) U11.41(AVDD33_2)
DVDD: C245.2 C246.2 C247.2 C256.2 C257.2 C258.2 U11.3(AVDD10_1) U11.9(AVDD10_2) U11.15(DVDD33_1) U11.21(DVDD33_2) U11.37(DVDD33_3) U11.40(AVDD10_3)  [also labelled AVDD1V_RGMII]
DVDD3V3_RGMII: C254.2 R69.2 R70.1 R71.2 R72.2 R73.2 R80.2 R82.2 R84.2 R86.2 R88.2 R89.2 R91.2
GND: C245.1 C246.1 C247.1 C248.1 C249.1 C250.1 C251.1 C252.1 C253.1 C254.1 C255.1 C256.1 C257.1 C258.1 C259.1 C260.1 C261.1 C262.1 C263.1 C264.1 R75.1 R81.1 R83.1 R85.1 R87.1 U11.47(GND1) U11.49(EXPAD1) Y3.2 Y3.4
VDD1V_RGMII: R77.1 R78.1
VDDREG: C248.2 C249.2 C259.2 C260.2 C261.2 C262.2 L1.2 R77.2 R78.2 U11.28(DVDD10_2) U11.36(DVDD10_1) U11.44(VDDREG_1) U11.45(VDDREG_2)  [also labelled DVDD1V_RGMII]
CKXTAL1: C263.2 U11.42(CKXTAL1) Y3.1
CKXTAL2: R90.2 U11.43(CKXTAL2)
LAN_LED0_AD0: R80.1 U11.34(LED0/PHY_AD0) ; off-sheet LAN_LED0_AD0
LAN_LED0_AD1: R83.2 U11.35(LED1/PHY_AD1) ; off-sheet LAN_LED0_AD1
LED2_RXDLY: R85.2 R86.1 U11.32(LED2/RXDLY)
MAC_COL: R84.1 U11.33(PME) ; off-sheet MAC_COL
MAC_CRS: C255.2 R73.1 U11.29(PHY_NRST) ; off-sheet MAC_CRS
MAC_MCLK: R74.1 ; off-sheet MAC_MCLK
MAC_MDC: U11.30(MDC) ; off-sheet MAC_MDC
MAC_MDIO: R71.1 U11.31(MDIO) ; off-sheet MAC_MDIO
MAC_RXCLK: R76.1 ; off-sheet MAC_RXCLK
MAC_RXD0: R88.1 U11.14(RXD0/SELRGV) ; off-sheet MAC_RXD0
MAC_RXD1: R81.2 R82.1 U11.16(RXD1/TXDLY) ; off-sheet MAC_RXD1
MAC_RXD2: R89.1 U11.17(RXD2/AIN0) ; off-sheet MAC_RXD2
MAC_RXD3: R91.1 U11.18(RXD3/AIN1) ; off-sheet MAC_RXD3
MAC_RXDV: R87.2 U11.13(RXCTL/PHY_AD2) ; off-sheet MAC_RXDV
MAC_RXER: R72.1 U11.20(INT) ; off-sheet MAC_RXER
MAC_TXCLK: R79.1 ; off-sheet MAC_TXCLK
MAC_TXD0: U11.23(TXD0) ; off-sheet MAC_TXD0
MAC_TXD1: U11.24(TXD1) ; off-sheet MAC_TXD1
MAC_TXD2: U11.25(TXD2) ; off-sheet MAC_TXD2
MAC_TXD3: U11.26(TXD3) ; off-sheet MAC_TXD3
MAC_TXEN: U11.27(TXCTL) ; off-sheet MAC_TXEN
MDI0_N: U11.2(MDI0_N) ; off-sheet MDI0_N
MDI0_P: U11.1(MDI0_P) ; off-sheet MDI0_P
MDI1_N: U11.5(MDI1_N) ; off-sheet MDI1_N
MDI1_P: U11.4(MDI1_P) ; off-sheet MDI1_P
MDI2_N: U11.8(MDI2_N) ; off-sheet MDI2_N
MDI2_P: U11.7(MDI2_P) ; off-sheet MDI2_P
MDI3_N: U11.11(MD3_N) ; off-sheet MDI3_N
MDI3_P: U11.10(MDI3_P) ; off-sheet MDI3_P
NetC252_2: C252.2 C253.2 R69.1
NetC264_2: C264.2 R90.1 Y3.3
NetL1_1: L1.1 U11.48(REG_OUT)
NetR74_2: R74.2 U11.46(CLK125)
NetR75_2: R75.2 U11.39(RSET)
NetR76_2: R76.2 U11.19(RXC)
NetR79_2: R79.2 U11.22(TXC)

Not connected (* = marked no-connect by the designer): U11 12(NC1)*

### Layout directives
differential pair: MDI0_N, MDI0_P, MDI1_N, MDI1_P, MDI2_N, MDI2_P, MDI3_N, MDI3_P
mark named 100_OHM_DIFF: MDI0_N, MDI0_P, MDI1_N, MDI1_P, MDI2_N, MDI2_P, MDI3_N, MDI3_P

### Notes on the sheet
- Sources
- Integrated Gigabit Ethernet transceiver (10/100/1000 Mbps)
- Ethernet
- Pull ups and pull downs
- Crystal 24MHz
- Title
- Size:
- Date:
- B
- Number:
- Time:
- Revision:
- Sheet
- of
- File:
- (in symbol XTAL_24Mhz-12pF-4-SMD) GND

### Library data of the parts
C245 C256 = CAP_1uF-16V-10%-0201: as C192 on sheet [4] RK3399_EMMC_ADC_PCIE; Case/Package: 0201; Supplier-1: Digikey
C246-C251 C254 C257-C260 C262 = CAP_100nF-25V-10%-0201: as C187-C190 on sheet [4] RK3399_EMMC_ADC_PCIE; Case/Package: 0201; Supplier-1: Digikey
C252 C253 = CAP_1uF-16V-10%-0402: 1µF ±10% 16V Ceramic Capacitor X5R 0402 (1005 Metric) /; Manufacturer: Knowles Novacap; Manufacturer Part Number: 0402BW105K160YT; Case/Package: 0402; Supplier-1: Digikey
C255 = CAP_4.7nF-10V-10%-0201: 4700pF ±10% 10V Ceramic Capacitor X7R 0201 (0603 Metric) /; Manufacturer: AVX Corporation; Manufacturer Part Number: 0201ZC472KAT2A; Case/Package: 0201; Supplier-1: Digikey
C261 = CAP_10uF-10V-20%-0402: as C243 on sheet [13] TYPEC0_PROG; Case/Package: 0402; Supplier-1: Digikey
C263 C264 = CAP_12pF-10V-10%-0402: 12pF ±10% 10V Ceramic Capacitor X8R 0402 (1005 Metric) /; Manufacturer: KEMET; Manufacturer Part Number: C0402C120K8HAC7867; Case/Package: 0402; Supplier-1: Digikey
L1 = IND_4.7uH-0.9A-20%-SMD: 4.7uH ±20% 900mA 425mΩ SMD,2.0x1.6x1.0mm Power Inductors RoHS /; Manufacturer: Sunlord; Manufacturer Part Number: WPN201610H4R7MT; Case/Package: SMD; Supplier-1: LCSC
R69 R70 R77 R78 = RES_0R-0.05W-1%-0201: 0 Ohms Jumper 0.05W, 1/20W Chip Resistor 0201 (0603 Metric) Automotive AEC-Q200 Thick Film; Manufacturer: Bourns Inc.; Manufacturer Part Number: CR0201AJ/-000GLF; Case/Package: 0201; Supplier-1: Digikey
R71-R73 R80-R89 R91 = RES_4.7K-0.1W-1%-0201: 4.02 kOhms ±1% 0.05W, 1/20W Chip Resistor 0201 (0603 Metric) Thick Film /; Manufacturer: Yageo; Manufacturer Part Number: RC0201FR-074K02L; Case/Package: 0201; Supplier-1: Digikey
R74 R76 R79 = RES_33R-0.05W-1%-0201: as R24 on sheet [4] RK3399_EMMC_ADC_PCIE; Case/Package: 0201; Supplier-1: Digikey
R75 = RES_2.49K-0.05W-1%-0201: 2.49 kOhms ±1% 0.05W, 1/20W Chip Resistor 0201 (0603 Metric) Automotive AEC-Q200 Thick Film /; Manufacturer: Panasonic Electronic Components; Manufacturer Part Number: ERJ-1GNF2491C; Case/Package: 0201; Supplier-1: Digikey
R90 = RES_1.1K-0.05W-1%-0201: 1.1 kOhms ±1% 0.05W, 1/20W Chip Resistor 0201 (0603 Metric) Automotive AEC-Q200 Thick Film /; Manufacturer: Panasonic Electronic Components; Manufacturer Part Number: ERJ-1GNF1101C; Case/Package: 0201; Supplier-1: Digikey
U11 = IC_RTL8211E-VB-CG: Ethernet Transceivers 10/100/1000 Base-T PHY GMII, MII, RGMII 1.43V ~ 3.63V QFN-48_6x6x04P Ethernet ICs RoHS; Manufacturer: Realtek Semicon; Manufacturer Part Number: RTL8211E-VB-CG; Case/Package: QFN-48; Supplier-1: LCSC
Y3 = XTAL_24Mhz-12pF-4-SMD: 24MHz ±20ppm Crystal 12pF 50 Ohms 4-SMD, No Lead /; Manufacturer: Abracon LLC; Manufacturer Part Number: ABM8AIG-24.000MHZ-12-2Z-T3; Case/Package: SMD; Supplier-1: Digikey